# EAGLE design AuxTalon (EAGLE 9.6.2)

## Sheet 1 of 3
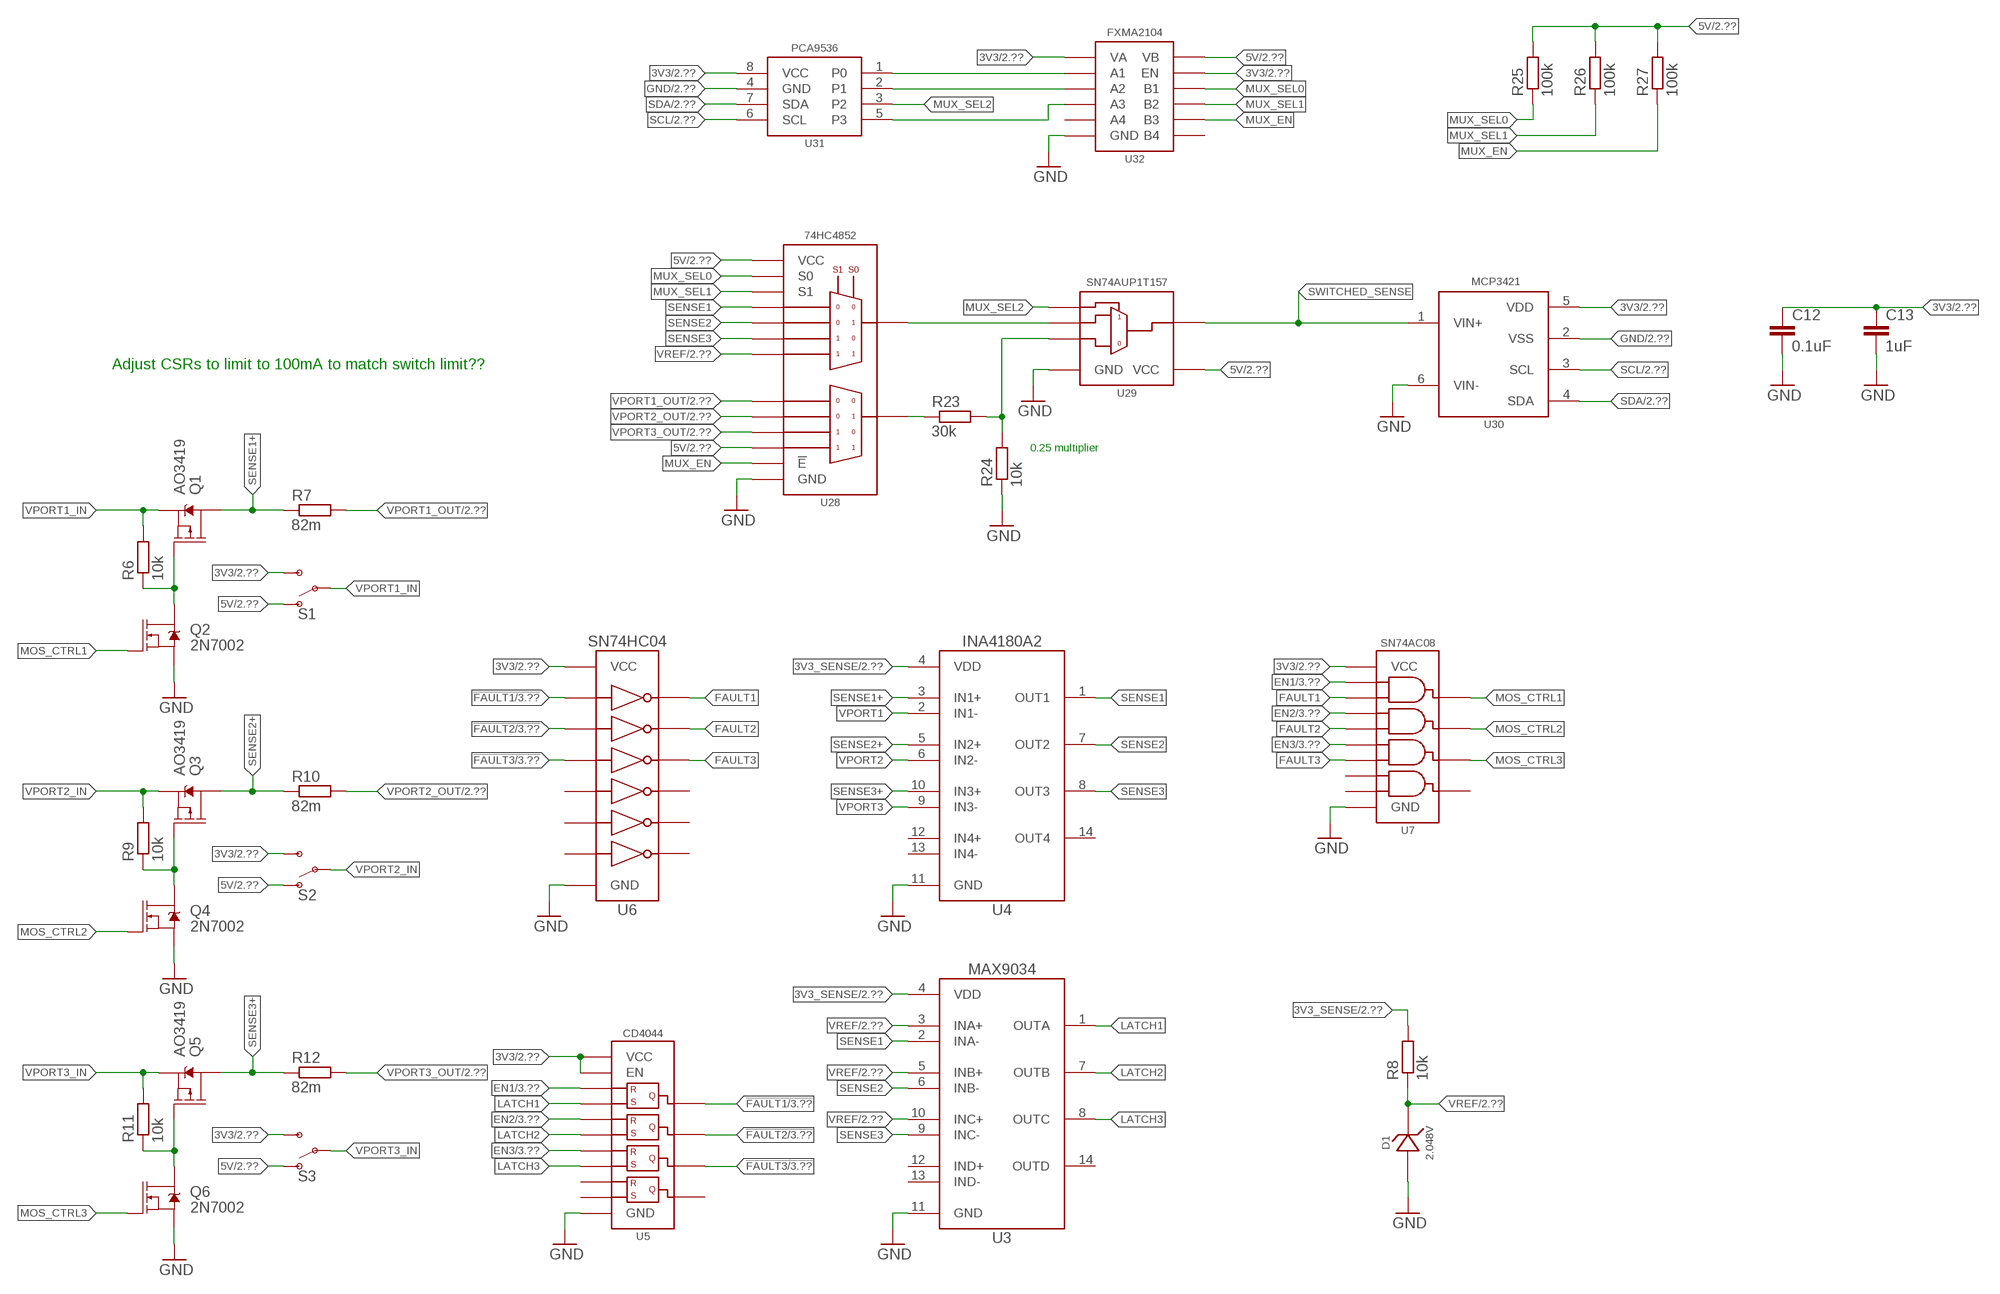
[diagram p0: schematic, sheet 1]

### Parts
C12  0.1uF  C-EU0.1UFC0402  [C0402]
C13  1uF  C-EU10UFC0805  [C0805]
D1  2.048V  LM40402.048  [SOT23-3]
Q1  AO3419  MOSFET-PCH-AO3419  [SOT23-3]
Q2  2N7002  MOSFET-NCH-2N7002P  [SOT23-3]
Q3  AO3419  MOSFET-PCH-AO3419  [SOT23-3]
Q4  2N7002  MOSFET-NCH-2N7002P  [SOT23-3]
Q5  AO3419  MOSFET-PCH-AO3419  [SOT23-3]
Q6  2N7002  MOSFET-NCH-2N7002P  [SOT23-3]
R6  10k  R-EU_10KR0402  [R0402]
R7  82m  R-EU_R0603  [R0603]
R8  10k  R-EU_10KR0402  [R0402]
R9  10k  R-EU_10KR0402  [R0402]
R10  82m  R-EU_R0603  [R0603]
R11  10k  R-EU_10KR0402  [R0402]
R12  82m  R-EU_R0603  [R0603]
R23  30k  R-EU_R0402  [R0402]
R24  10k  R-EU_10KR0402  [R0402]
R25  100k  R-EU_100KR0402  [R0402]
R26  100k  R-EU_100KR0402  [R0402]
R27  100k  R-EU_100KR0402  [R0402]
S1  SPDTCAS-120A1  [CAS-120A1]
S2  SPDTCAS-120A1  [CAS-120A1]
S3  SPDTCAS-120A1  [CAS-120A1]
U3  MAX9034TSSOP  [TSSOP14]
U4  INA4180A2  [TSSOP14]
U5  CD4044  [TSSOP16]
U6  SN74HC04  [TSSOP14]
U7  SN74AC08  [TSSOP14]
U28  74HC4852  [VQFN-16]
U29  SN74AUP1T157DCK  [DCK_R-PDSO-G6]
U30  MCP3421A3  [SOT23-6L]
U31  PCA9536DFN  [DFN_8_3X3]
U32  FXMA2104  [MLP_12]

### Nets
3V3: C12.1 C13.1 S1.3(S) S2.3(S) S3.3(S) U5.5(EN) U5.16(VCC) U6.14(VCC) U7.14(VCC) U30.5(VDD) U31.8(VCC) U32.2(VA) U32.8(EN) ; also sheet 2,3
3V3_SENSE: R8.2 U3.4(VDD) U4.4(VDD) ; also sheet 2
5V: R25.2 R26.2 R27.2 S1.1(O) S2.1(O) S3.1(O) U28.4(2Y3) U28.16(VCC) U29.5(VCC) U32.1(VB) ; also sheet 2
!FAULT1: U5.13(Q1) U6.1(A1) ; also sheet 3
!FAULT2: U5.9(Q2) U6.3(A2) ; also sheet 3
!FAULT3: U5.10(Q3) U6.5(A3) ; also sheet 3
EN1: U5.4(R1) U7.1(A1) ; also sheet 3
EN2: U5.6(R2) U7.4(A2) ; also sheet 3
EN3: U5.12(R3) U7.9(A3) ; also sheet 3
FAULT1: U6.2(Y1) U7.2(B1)
FAULT2: U6.4(Y2) U7.5(B2)
FAULT3: U6.6(Y3) U7.10(B3)
GND: C12.2 C13.2 D1.2(A) Q2.2(S) Q4.2(S) Q6.2(S) R24.1 U3.11(GND) U4.11(GND) U5.8(GND) U6.7(GND) U7.7(GND) U28.8(GND) U28.EP(GND) U29.2(GND) U30.2(VSS) U30.6(VIN-) U31.4(GND) U32.7(GND) ; also sheet 2,3
LATCH1: U3.1(OUTA) U5.3(S1)
LATCH2: U3.7(OUTB) U5.7(S2)
LATCH3: U3.8(OUTC) U5.11(S3)
MOS_CTRL1: Q2.1(G) U7.3(Y1)
MOS_CTRL2: Q4.1(G) U7.6(Y2)
MOS_CTRL3: Q6.1(G) U7.8(Y3)
MUX_EN: R27.1 U28.6(!E) U32.10(B3)
MUX_SEL0: R25.1 U28.10(S0) U32.12(B1)
MUX_SEL1: R26.1 U28.9(S1) U32.11(B2)
MUX_SEL2: U29.4(C) U31.3(P2) ; also sheet 3
N$1: Q3.1(G) Q4.3(D) R9.1
N$2: Q1.1(G) Q2.3(D) R6.1
N$3: Q5.1(G) Q6.3(D) R11.1
N$18: R23.1 U28.3(2Z)
N$19: R23.2 R24.2 U29.3(B)
N$24: U31.1(P0) U32.3(A1)
N$25: U31.2(P1) U32.4(A2)
N$28: U31.5(P3) U32.5(A3)
N$38: U28.13(1Z) U29.1(A)
SCL: U30.3(SCL) U31.6(SCL) ; also sheet 2,3
SDA: U30.4(SDA) U31.7(SDA) ; also sheet 2,3
SENSE1: U3.2(INA-) U4.1(OUT1) U28.12(1Y0)
SENSE1+: Q1.3(D) R7.1 U4.3(IN1+)
SENSE2: U3.6(INB-) U4.7(OUT2) U28.14(1Y1)
SENSE2+: Q3.3(D) R10.1 U4.5(IN2+)
SENSE3: U3.9(INC-) U4.8(OUT3) U28.15(1Y2)
SENSE3+: Q5.3(D) R12.1 U4.10(IN3+)
SWITCHED_SENSE: U29.6(Y) U30.1(VIN+)
VPORT1: U4.2(IN1-)
VPORT1_IN: Q1.2(S) R6.2 S1.2(P)
VPORT1_OUT: R7.2 U28.1(2Y0) ; also sheet 2
VPORT2: U4.6(IN2-)
VPORT2_IN: Q3.2(S) R9.2 S2.2(P)
VPORT2_OUT: R10.2 U28.5(2Y1) ; also sheet 2
VPORT3: U4.9(IN3-)
VPORT3_IN: Q5.2(S) R11.2 S3.2(P)
VPORT3_OUT: R12.2 U28.2(2Y2) ; also sheet 2
VREF: D1.1(C) R8.1 U3.3(INA+) U3.5(INB+) U3.10(INC+) U28.11(1Y3) ; also sheet 2
Unconnected: U3.12(IND+) U3.13(IND-) U3.14(OUTD) U4.12(IN4+) U4.13(IN4-) U4.14(OUT4) U5.1(Q4) U5.14(R4) U5.15(S4) U6.8(Y4) U6.9(A4) U6.10(Y5) U6.11(A5) U6.12(Y6) U6.13(A6) U7.11(Y4) U7.12(A4) U7.13(B4) U32.6(A4) U32.9(B4)

### Notes on the sheet
- Adjust CSRs to limit to 100mA to match switch limit??
- 0.25 multiplier

## Sheet 2 of 3
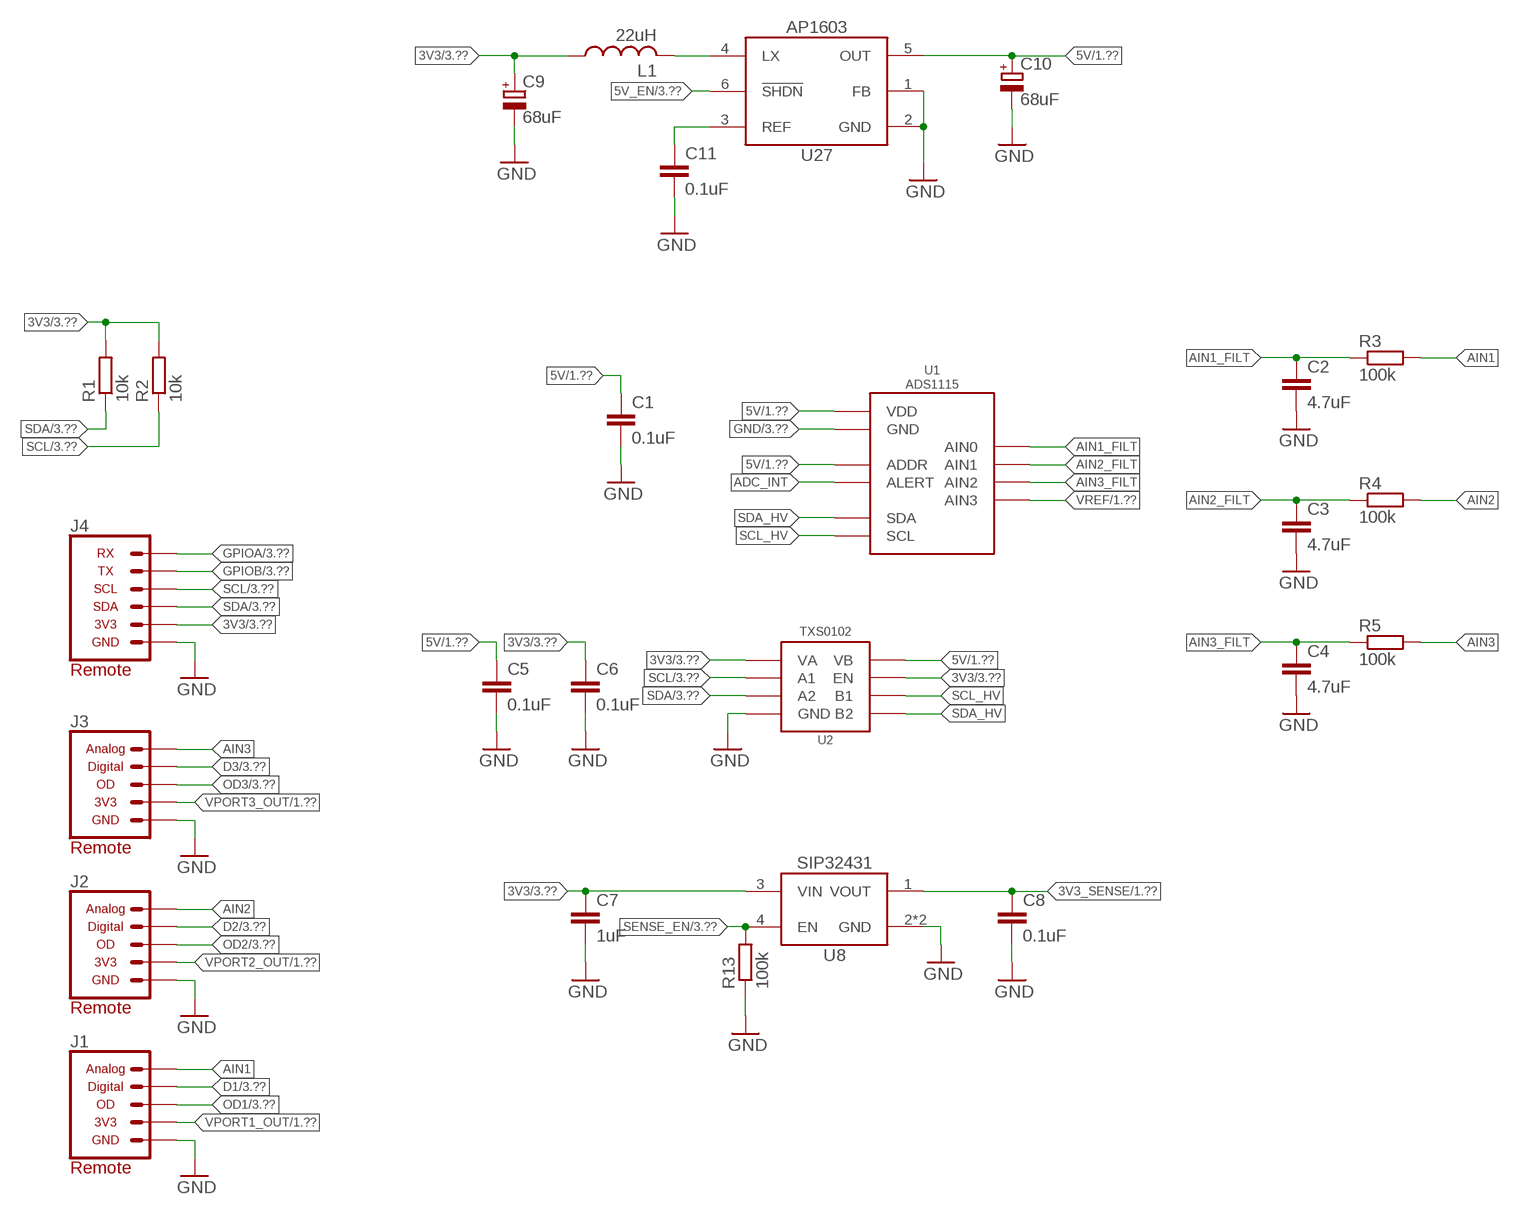
[diagram p1: schematic, sheet 2]

### Parts
C1  0.1uF  C-EU0.1UFC0402  [C0402]
C2  4.7uF  C-EU4.7UFC0805  [C0805]
C3  4.7uF  C-EU4.7UFC0805  [C0805]
C4  4.7uF  C-EU4.7UFC0805  [C0805]
C5  0.1uF  C-EU0.1UFC0402  [C0402]
C6  0.1uF  C-EU0.1UFC0402  [C0402]
C7  1uF  C-EU1UFC0603  [C0603]
C8  0.1uF  C-EU0.1UFC0402  [C0402]
C9  68uF  CPOL-EU153CLV-0605  [153CLV-0605]
C10  68uF  CPOL-EU153CLV-0605  [153CLV-0605]
C11  0.1uF  C-EU0.1UFC0402  [C0402]
J1  CONN_AUX_M12_REMOTE  [1X05_M12_TE_T41410]
J2  CONN_AUX_M12_REMOTE  [1X05_M12_TE_T41410]
J3  CONN_AUX_M12_REMOTE  [1X05_M12_TE_T41410]
J4  CONN_TALON_REMOTE  [1X06_MICROLOCKPLUS]
L1  22uH  INDUCTOR_TPC_3.8X3.8  [WE-TPC(3.8X3.8)]
R1  10k  R-EU_10KR0402  [R0402]
R2  10k  R-EU_10KR0402  [R0402]
R3  100k  R-EU_100KR0402  [R0402]
R4  100k  R-EU_100KR0402  [R0402]
R5  100k  R-EU_100KR0402  [R0402]
R13  100k  R-EU_100KR0402  [R0402]
U1  ADS1115  [VSSOP_10]
U2  TXS0102DCU  [DCU_(R-PDSO-G8)]
U8  SIP32431TDFN  [TDFN_4]
U27  AP1603  [TSOT23-6_DDC]

### Nets
3V3: C6.1 C7.1 C9.+ J4.5(3V3) L1.1 R1.2 R2.2 U2.3(VA) U2.6(EN) U8.3(VIN) ; also sheet 1,3
3V3_SENSE: C8.1 U8.1(VOUT) ; also sheet 1
5V: C1.1 C5.1 C10.+ U1.1(ADDR) U1.8(VDD) U2.7(VB) U27.5(OUT) ; also sheet 1
5V_EN: U27.6(!SHDN) ; also sheet 3
ADC_INT: U1.2(ALERT)
AIN1: J1.4(ANALOG) R3.2
AIN1_FILT: C2.1 R3.1 U1.4(AIN0)
AIN2: J2.4(ANALOG) R4.2
AIN2_FILT: C3.1 R4.1 U1.5(AIN1)
AIN3: J3.4(ANALOG) R5.2
AIN3_FILT: C4.1 R5.1 U1.6(AIN2)
D1: J1.5(DIGITAL) ; also sheet 3
D2: J2.5(DIGITAL) ; also sheet 3
D3: J3.5(DIGITAL) ; also sheet 3
GND: C1.2 C2.2 C3.2 C4.2 C5.2 C6.2 C7.2 C8.2 C9.- C10.- C11.2 J1.3(GND) J2.3(GND) J3.3(GND) J4.6(GND) R13.1 U1.3(GND) U2.2(GND) U8.2(GND) U8.EP(GND) U27.1(FB) U27.2(GND) ; also sheet 1,3
GPIOA: J4.1(RX) ; also sheet 3
GPIOB: J4.2(TX) ; also sheet 3
N$15: C11.1 U27.3(REF)
N$17: L1.2 U27.4(LX)
OD1: J1.2(DIGITAL_OPENDRAIN) ; also sheet 3
OD2: J2.2(DIGITAL_OPENDRAIN) ; also sheet 3
OD3: J3.2(DIGITAL_OPENDRAIN) ; also sheet 3
SCL: J4.3(SCL) R2.1 U2.5(A1) ; also sheet 1,3
SCL_HV: U1.10(SCL) U2.8(B1)
SDA: J4.4(SDA) R1.1 U2.4(A2) ; also sheet 1,3
SDA_HV: U1.9(SDA) U2.1(B2)
SENSE_EN: R13.2 U8.4(EN) ; also sheet 3
VPORT1_OUT: J1.1(3V3) ; also sheet 1
VPORT2_OUT: J2.1(3V3) ; also sheet 1
VPORT3_OUT: J3.1(3V3) ; also sheet 1
VREF: U1.7(AIN3) ; also sheet 1

## Sheet 3 of 3
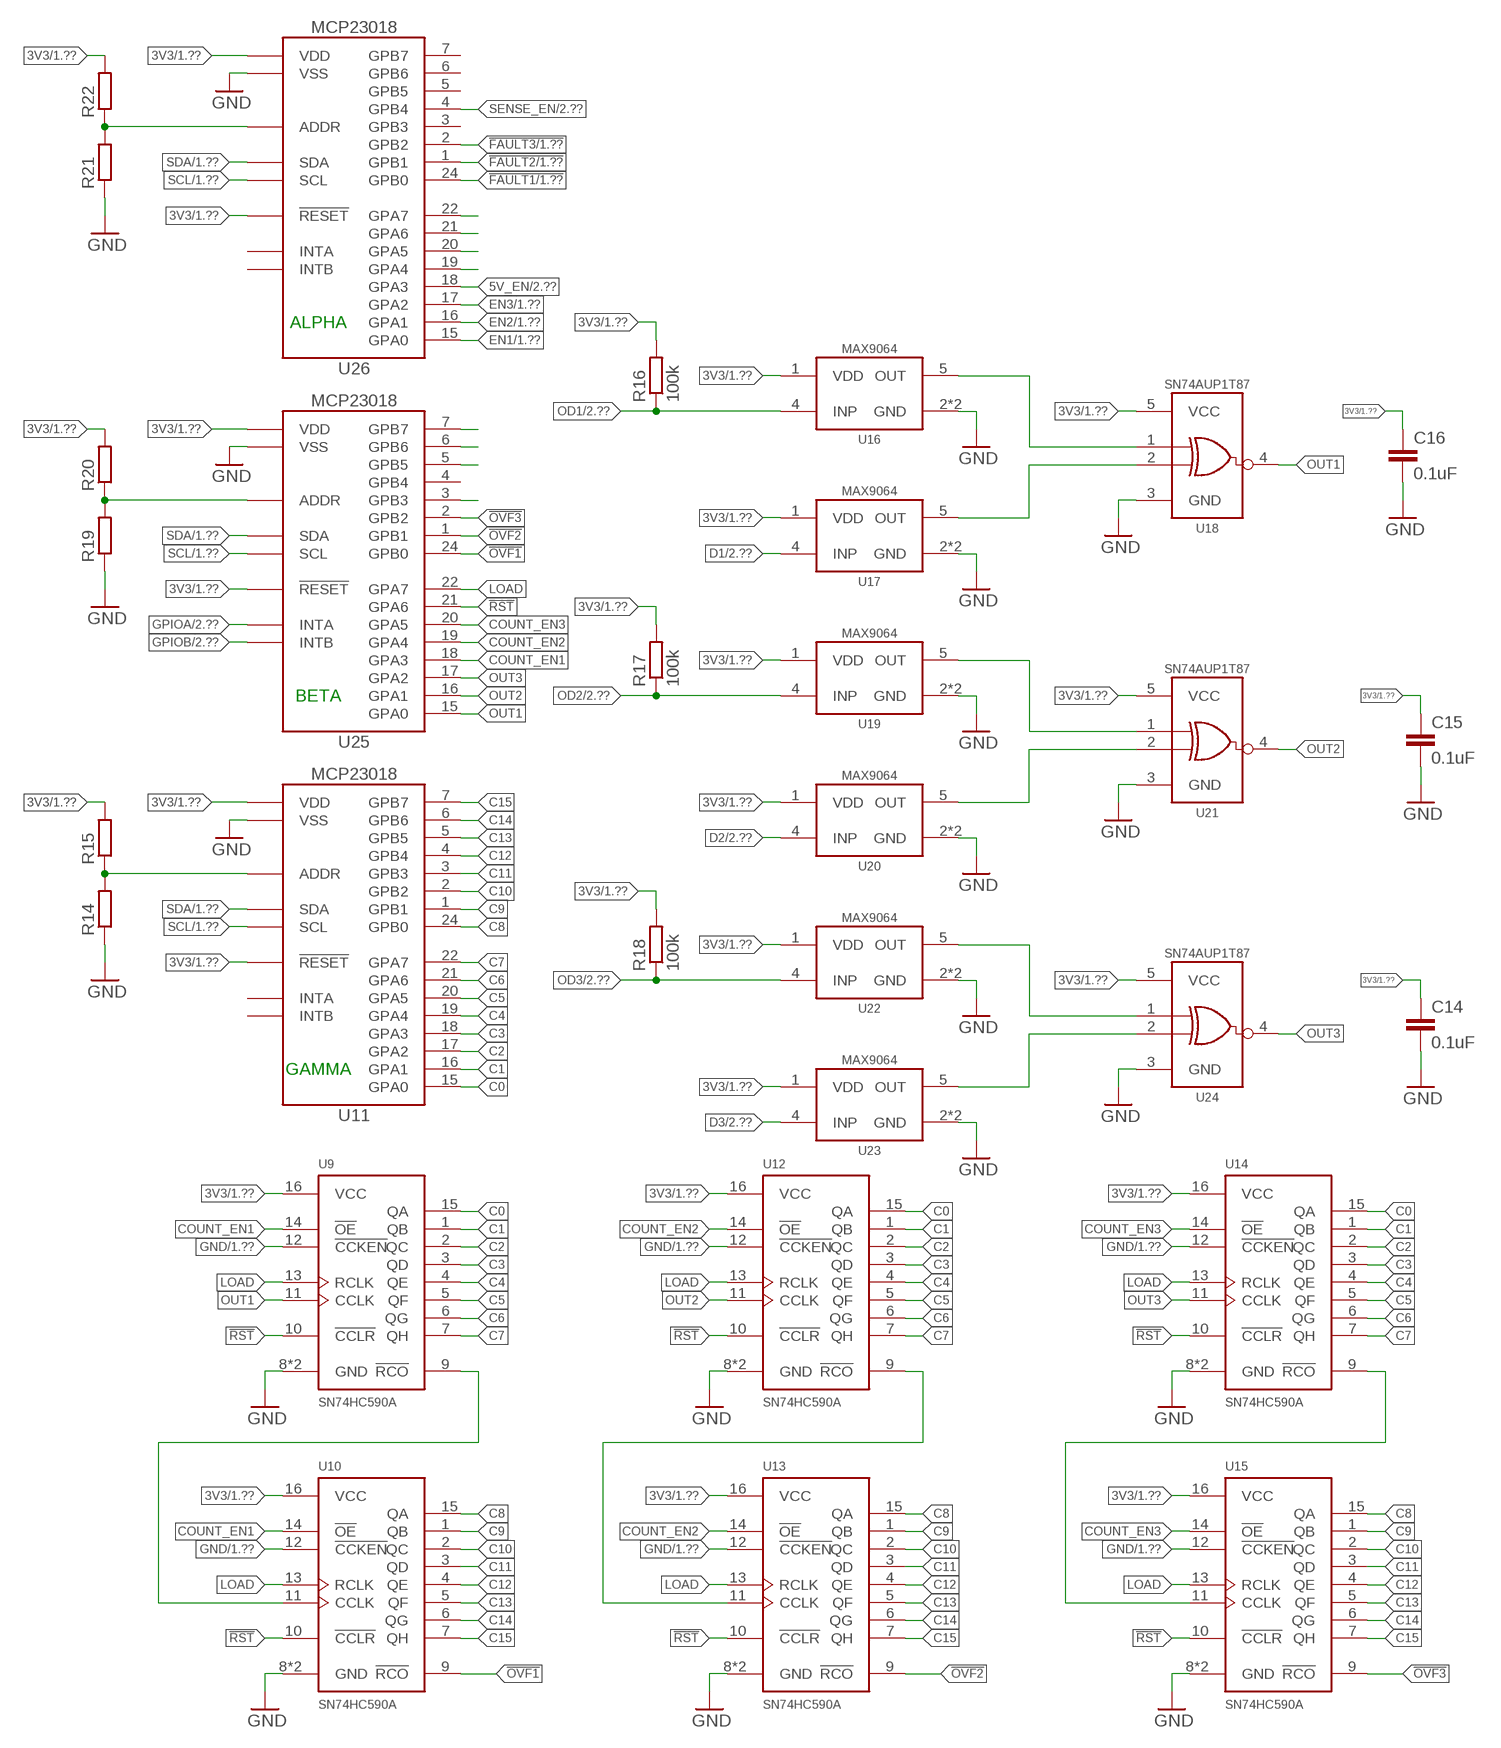
[diagram p2: schematic, sheet 3]

### Parts
C14  0.1uF  C-EU0.1UFC0402  [C0402]
C15  0.1uF  C-EU0.1UFC0402  [C0402]
C16  0.1uF  C-EU0.1UFC0402  [C0402]
R14  R-EU_R0603  [R0603]
R15  R-EU_R0603  [R0603]
R16  100k  R-EU_100KR0402  [R0402]
R17  100k  R-EU_100KR0402  [R0402]
R18  100k  R-EU_100KR0402  [R0402]
R19  R-EU_R0603  [R0603]
R20  R-EU_R0603  [R0603]
R21  R-EU_R0603  [R0603]
R22  R-EU_R0603  [R0603]
U9  SN74HC590AVQFN  [VQFN-16]
U10  SN74HC590AVQFN  [VQFN-16]
U11  MCP23018QFN  [QFN24]
U12  SN74HC590AVQFN  [VQFN-16]
U13  SN74HC590AVQFN  [VQFN-16]
U14  SN74HC590AVQFN  [VQFN-16]
U15  SN74HC590AVQFN  [VQFN-16]
U16  MAX9064  [SOT23-5]
U17  MAX9064  [SOT23-5]
U18  SN74AUP1T87  [DCK_R-PDSO-G5]
U19  MAX9064  [SOT23-5]
U20  MAX9064  [SOT23-5]
U21  SN74AUP1T87  [DCK_R-PDSO-G5]
U22  MAX9064  [SOT23-5]
U23  MAX9064  [SOT23-5]
U24  SN74AUP1T87  [DCK_R-PDSO-G5]
U25  MCP23018QFN  [QFN24]
U26  MCP23018QFN  [QFN24]

### Nets
3V3: C14.1 C15.1 C16.1 R15.2 R16.2 R17.2 R18.2 R20.2 R22.2 U9.16(VCC) U10.16(VCC) U11.8(VDD) U11.12(!RESET) U12.16(VCC) U13.16(VCC) U14.16(VCC) U15.16(VCC) U16.1(VDD) U17.1(VDD) U18.5(VCC) U19.1(VDD) U20.1(VDD) U21.5(VCC) U22.1(VDD) U23.1(VDD) U24.5(VCC) U25.8(VDD) U25.12(!RESET) U26.8(VDD) U26.12(!RESET) ; also sheet 1,2
5V_EN: U26.18(GPA3) ; also sheet 2
!FAULT1: U26.24(GPB0) ; also sheet 1
!FAULT2: U26.1(GPB1) ; also sheet 1
!FAULT3: U26.2(GPB2) ; also sheet 1
!OVF1: U10.9(!RCO) U25.24(GPB0)
!OVF2: U13.9(!RCO) U25.1(GPB1)
!OVF3: U15.9(!RCO) U25.2(GPB2)
!RST: U9.10(!CCLR) U10.10(!CCLR) U12.10(!CCLR) U13.10(!CCLR) U14.10(!CCLR) U15.10(!CCLR) U25.21(GPA6)
C0: U9.15(QA) U11.15(GPA0) U12.15(QA) U14.15(QA)
C1: U9.1(QB) U11.16(GPA1) U12.1(QB) U14.1(QB)
C2: U9.2(QC) U11.17(GPA2) U12.2(QC) U14.2(QC)
C3: U9.3(QD) U11.18(GPA3) U12.3(QD) U14.3(QD)
C4: U9.4(QE) U11.19(GPA4) U12.4(QE) U14.4(QE)
C5: U9.5(QF) U11.20(GPA5) U12.5(QF) U14.5(QF)
C6: U9.6(QG) U11.21(GPA6) U12.6(QG) U14.6(QG)
C7: U9.7(QH) U11.22(GPA7) U12.7(QH) U14.7(QH)
C8: U10.15(QA) U11.24(GPB0) U13.15(QA) U15.15(QA)
C9: U10.1(QB) U11.1(GPB1) U13.1(QB) U15.1(QB)
C10: U10.2(QC) U11.2(GPB2) U13.2(QC) U15.2(QC)
C11: U10.3(QD) U11.3(GPB3) U13.3(QD) U15.3(QD)
C12: U10.4(QE) U11.4(GPB4) U13.4(QE) U15.4(QE)
C13: U10.5(QF) U11.5(GPB5) U13.5(QF) U15.5(QF)
C14: U10.6(QG) U11.6(GPB6) U13.6(QG) U15.6(QG)
C15: U10.7(QH) U11.7(GPB7) U13.7(QH) U15.7(QH)
COUNT_EN1: U9.14(!OE) U10.14(!OE) U25.18(GPA3)
COUNT_EN2: U12.14(!OE) U13.14(!OE) U25.19(GPA4)
COUNT_EN3: U14.14(!OE) U15.14(!OE) U25.20(GPA5)
D1: U17.4(INP) ; also sheet 2
D2: U20.4(INP) ; also sheet 2
D3: U23.4(INP) ; also sheet 2
EN1: U26.15(GPA0) ; also sheet 1
EN2: U26.16(GPA1) ; also sheet 1
EN3: U26.17(GPA2) ; also sheet 1
GND: C14.2 C15.2 C16.2 R14.1 R19.1 R21.1 U9.8(GND) U9.12(!CCKEN) U9.EP(GND) U10.8(GND) U10.12(!CCKEN) U10.EP(GND) U11.23(VSS) U11.EP(VSS) U12.8(GND) U12.12(!CCKEN) U12.EP(GND) U13.8(GND) U13.12(!CCKEN) U13.EP(GND) U14.8(GND) U14.12(!CCKEN) U14.EP(GND) U15.8(GND) U15.12(!CCKEN) U15.EP(GND) U16.2(GND) U16.3(GND) U17.2(GND) U17.3(GND) U18.3(GND) U19.2(GND) U19.3(GND) U20.2(GND) U20.3(GND) U21.3(GND) U22.2(GND) U22.3(GND) U23.2(GND) U23.3(GND) U24.3(GND) U25.23(VSS) U25.EP(VSS) U26.23(VSS) U26.EP(VSS) ; also sheet 1,2
GPIOA: U25.14(INTA) ; also sheet 2
GPIOB: U25.13(INTB) ; also sheet 2
LOAD: U9.13(RCLK) U10.13(RCLK) U12.13(RCLK) U13.13(RCLK) U14.13(RCLK) U15.13(RCLK) U25.22(GPA7)
MUX_SEL2: U25.5(GPB5) ; also sheet 1
N$4: U9.9(!RCO) U10.11(CCLK)
N$5: U12.9(!RCO) U13.11(CCLK)
N$6: U14.9(!RCO) U15.11(CCLK)
N$7: R14.2 R15.1 U11.11(ADDR)
N$8: U20.5(OUT) U21.2(B)
N$9: U19.5(OUT) U21.1(A)
N$10: U16.5(OUT) U18.1(A)
N$11: U17.5(OUT) U18.2(B)
N$12: U23.5(OUT) U24.2(B)
N$13: U22.5(OUT) U24.1(A)
N$14: R21.2 R22.1 U26.11(ADDR)
N$16: R19.2 R20.1 U25.11(ADDR)
N$20: U26.19(GPA4)
N$21: U26.20(GPA5)
N$22: U26.21(GPA6)
N$23: U26.22(GPA7)
N$26: U25.3(GPB3)
N$29: U25.6(GPB6)
N$30: U25.7(GPB7)
OD1: R16.1 U16.4(INP) ; also sheet 2
OD2: R17.1 U19.4(INP) ; also sheet 2
OD3: R18.1 U22.4(INP) ; also sheet 2
OUT1: U9.11(CCLK) U18.4(Y) U25.15(GPA0)
OUT2: U12.11(CCLK) U21.4(Y) U25.16(GPA1)
OUT3: U14.11(CCLK) U24.4(Y) U25.17(GPA2)
SCL: U11.9(SCL) U25.9(SCL) U26.9(SCL) ; also sheet 1,2
SDA: U11.10(SDA) U25.10(SDA) U26.10(SDA) ; also sheet 1,2
SENSE_EN: U26.4(GPB4) ; also sheet 2
Unconnected: U11.13(INTB) U11.14(INTA) U25.4(GPB4) U26.3(GPB3) U26.5(GPB5) U26.6(GPB6) U26.7(GPB7) U26.13(INTB) U26.14(INTA)

### Notes on the sheet
- ALPHA
- BETA
- GAMMA

## Library data of the parts
C1 C5 C6 C8 C11 C12 C14-C16 = bschulz_passives:C-EU: CAPACITOR, European symbol; DIGIKEY: 490-4759-1-ND; MF: Murata; MPN: GCM155R71C104KA55D
C2-C4 = bschulz_passives:C-EU: CAPACITOR, European symbol; DIGIKEY: 399-7415-1-ND; MF: Kemet; MPN: C0805C475K4RACTU
C7 = bschulz_passives:C-EU: CAPACITOR, European symbol; DIGIKEY: 587-1251-1-ND; MF: Yaiyo Yuden; MPN: EMK107BJ105KA-T
C9 C10 = bschulz_passives:CPOL-EU: POLARIZED CAPACITOR, European symbol; SPICEPREFIX: C
C13 = bschulz_passives:C-EU: CAPACITOR, European symbol; DIGIKEY: 490-6473-1-ND; MF: Murata; MPN: GRM21BR61C106KE15K
D1 = bschulz:LM4040: LM4040 - Precision Micropower Shunt Voltage Referance Characteristics: VReverseBreakdown: 1.225V, 2.5V, 4.096V, 5.0V Output Current: 15 mA Tolerance: 1% Temp Coeficient: ±15ppm/C° Operating Temperature: -40°C to 85°C Digikey: 576-1047-1-ND (Microchip, 2.5V) <https://www.digikey.com/product-detail/en/microchip-technology/LM4040DYM3-2.5-TR/576-1047-1-ND/771818> 576-1048-1-ND (Microchip, 4.096V) <https://www.digikey.com/product-detail/en/microchip-technology/LM4040DYM3-4.1-TR/576-1048-1-ND/771819> 5LM4040CIM3-2.0/NOPBCT-ND (TI, 2.048V) <https://www.digikey.com/product-detail/en/texas-instruments/LM4040CIM3-2.0-NOPB/LM4040CIM3-2.0-NOPBCT-ND/2350623>; DIGIKEY: LM4040CIM3-2.0/NOPBCT-ND; MF: TI; MPN: LM4040CIM3-2.0/NOPB
J1-J3 = GEMS_Plugs:CONN_AUX: GEMS Connector for Auiliary Port Devices; DIGIKEY: A126851-ND; DISP: Remote; MF: TE; MPN: T4141012051-000
J4 = GEMS_Plugs:CONN_TALON: GEMS Connector for Talon Interface; DISP: Remote
L1 = bschulz:INDUCTOR: Genaric Inductor
Q1 Q3 Q5 = bschulz:MOSFET-PCH: P-channel MOSFET Small Signal/Low Power:; DIGIKEY: 785-1013-1-ND; MF: Alpha and Omega; MPN: AO3419
Q2 Q4 Q6 = bschulz:MOSFET-NCH: N-channel MOSFET Small Signal/Low Power: BSS138 2N7002P 2N7002PW RE1C002UN; DIGIKEY: 1727-4692-1-ND; MF: Nexperia; MPN: 2N7002P,215
R1 R2 R6 R8 R9 R11 R24 = bschulz_passives:R-EU_: RESISTOR, European symbol Digikey Parts: Yageo, 0402 <https://www.digikey.com/products/en/resistors/chip-resistor-surface-mount/52?k=&pkeyword=&sv=0&s=4356&sf=1&FV=-1%7C13%2C7%7C2%2C1291%7C39157%2C1989%7C0%2C-8%7C52%2C3%7C1131%2C3%7C2503&quantity=&ColumnSort=0&page=1&stock=1&pageSize=25> Yageo, 0603 <https://www.digikey.com/products/en/resistors/chip-resistor-surface-mount/52?k=&pkeyword=&sv=0&pv1291=39245&sf=1&FV=-5%7C4356%2C-5%7C47360%2C-8%7C52%2C-1%7C13%2C7%7C2%2C1989%7C0&quantity=10&ColumnSort=1000011&page=1&stock=1&pageSize=25> Panasonic, 0603 <https://www.digikey.com/products/en/resistors/chip-resistor-surface-mount/52?k=&pkeyword=&pv252=68&sf=0&FV=ffec373d%2C1c0002%2C142c040c%2C1f140000%2Cffe00034%2C80002%2Cc0001&quantity=&ColumnSort=0&page=1&stock=1&pageSize=25> Panasonic, precision, 0603 <https://www.digikey.com/products/en/resistors/chip-resistor-surface-mount/52?FV=ffec4907%2Cfffc000a%2Cc0172%2C142c040c%2C1f140000%2Cffe00034%2C1c0002&quantity=100&ColumnSort=2085&page=1&stock=1&pageSize=25> Panasonic, 0805 <https://www.digikey.com/products/en/resistors/chip-resistor-surface-mount/52?k=&pkeyword=&pv3=1&sf=0&FV=ffec373d%2C1c0002%2C1f140000%2Cffe00034%2C142c040d&quantity=&ColumnSort=0&page=1&stock=1&pageSize=25> Rohm, current sense <https://www.digikey.com/products/en/resistors/chip-resistor-surface-mount/52?k=&pkeyword=&pv3=1&sf=0&FV=ffecb688%2C1f140000%2Cffe00034%2C1c0002&quantity=&ColumnSort=0&page=1&stock=1&pageSize=25> Vishay, pulse proof automotive <https://www.digikey.com/products/en/resistors/chip-resistor-surface-mount/52?k=&pkeyword=&pv7=2&sf=0&FV=ffec5d6b%2Cffe00034%2C1f140000&quantity=&ColumnSort=0&page=1&stock=1&pageSize=25>; DIGIKEY: 311-10.0KLRCT-ND; MF: Yageo; MPN: RC0402FR-0710KL; VALUE_PART: 10k
R3-R5 R13 R16-R18 R25-R27 = bschulz_passives:R-EU_: RESISTOR, European symbol Digikey Parts: Yageo, 0402 <https://www.digikey.com/products/en/resistors/chip-resistor-surface-mount/52?k=&pkeyword=&sv=0&s=4356&sf=1&FV=-1%7C13%2C7%7C2%2C1291%7C39157%2C1989%7C0%2C-8%7C52%2C3%7C1131%2C3%7C2503&quantity=&ColumnSort=0&page=1&stock=1&pageSize=25> Yageo, 0603 <https://www.digikey.com/products/en/resistors/chip-resistor-surface-mount/52?k=&pkeyword=&sv=0&pv1291=39245&sf=1&FV=-5%7C4356%2C-5%7C47360%2C-8%7C52%2C-1%7C13%2C7%7C2%2C1989%7C0&quantity=10&ColumnSort=1000011&page=1&stock=1&pageSize=25> Panasonic, 0603 <https://www.digikey.com/products/en/resistors/chip-resistor-surface-mount/52?k=&pkeyword=&pv252=68&sf=0&FV=ffec373d%2C1c0002%2C142c040c%2C1f140000%2Cffe00034%2C80002%2Cc0001&quantity=&ColumnSort=0&page=1&stock=1&pageSize=25> Panasonic, precision, 0603 <https://www.digikey.com/products/en/resistors/chip-resistor-surface-mount/52?FV=ffec4907%2Cfffc000a%2Cc0172%2C142c040c%2C1f140000%2Cffe00034%2C1c0002&quantity=100&ColumnSort=2085&page=1&stock=1&pageSize=25> Panasonic, 0805 <https://www.digikey.com/products/en/resistors/chip-resistor-surface-mount/52?k=&pkeyword=&pv3=1&sf=0&FV=ffec373d%2C1c0002%2C1f140000%2Cffe00034%2C142c040d&quantity=&ColumnSort=0&page=1&stock=1&pageSize=25> Rohm, current sense <https://www.digikey.com/products/en/resistors/chip-resistor-surface-mount/52?k=&pkeyword=&pv3=1&sf=0&FV=ffecb688%2C1f140000%2Cffe00034%2C1c0002&quantity=&ColumnSort=0&page=1&stock=1&pageSize=25> Vishay, pulse proof automotive <https://www.digikey.com/products/en/resistors/chip-resistor-surface-mount/52?k=&pkeyword=&pv7=2&sf=0&FV=ffec5d6b%2Cffe00034%2C1f140000&quantity=&ColumnSort=0&page=1&stock=1&pageSize=25>; DIGIKEY: 311-100KLRCT-ND; MF: Yageo; MPN: RC0402FR-07100KL; VALUE_PART: 100k
R7 R10 R12 R14 R15 R19-R23 = bschulz_passives:R-EU_: RESISTOR, European symbol Digikey Parts: Yageo, 0402 <https://www.digikey.com/products/en/resistors/chip-resistor-surface-mount/52?k=&pkeyword=&sv=0&s=4356&sf=1&FV=-1%7C13%2C7%7C2%2C1291%7C39157%2C1989%7C0%2C-8%7C52%2C3%7C1131%2C3%7C2503&quantity=&ColumnSort=0&page=1&stock=1&pageSize=25> Yageo, 0603 <https://www.digikey.com/products/en/resistors/chip-resistor-surface-mount/52?k=&pkeyword=&sv=0&pv1291=39245&sf=1&FV=-5%7C4356%2C-5%7C47360%2C-8%7C52%2C-1%7C13%2C7%7C2%2C1989%7C0&quantity=10&ColumnSort=1000011&page=1&stock=1&pageSize=25> Panasonic, 0603 <https://www.digikey.com/products/en/resistors/chip-resistor-surface-mount/52?k=&pkeyword=&pv252=68&sf=0&FV=ffec373d%2C1c0002%2C142c040c%2C1f140000%2Cffe00034%2C80002%2Cc0001&quantity=&ColumnSort=0&page=1&stock=1&pageSize=25> Panasonic, precision, 0603 <https://www.digikey.com/products/en/resistors/chip-resistor-surface-mount/52?FV=ffec4907%2Cfffc000a%2Cc0172%2C142c040c%2C1f140000%2Cffe00034%2C1c0002&quantity=100&ColumnSort=2085&page=1&stock=1&pageSize=25> Panasonic, 0805 <https://www.digikey.com/products/en/resistors/chip-resistor-surface-mount/52?k=&pkeyword=&pv3=1&sf=0&FV=ffec373d%2C1c0002%2C1f140000%2Cffe00034%2C142c040d&quantity=&ColumnSort=0&page=1&stock=1&pageSize=25> Rohm, current sense <https://www.digikey.com/products/en/resistors/chip-resistor-surface-mount/52?k=&pkeyword=&pv3=1&sf=0&FV=ffecb688%2C1f140000%2Cffe00034%2C1c0002&quantity=&ColumnSort=0&page=1&stock=1&pageSize=25> Vishay, pulse proof automotive <https://www.digikey.com/products/en/resistors/chip-resistor-surface-mount/52?k=&pkeyword=&pv7=2&sf=0&FV=ffec5d6b%2Cffe00034%2C1f140000&quantity=&ColumnSort=0&page=1&stock=1&pageSize=25>; MF: Yageo
S1-S3 = bschulz:SPDT: Genaric SPDT switch; DIGIKEY: CAS120JCT-ND; MF: Nidec Copal; MPN: CAS-120TA
U1 = bschulz:ADS111*: ADS1115 - Sigma Delta ADC Characteristics: VCC: 2~5.5V Resolution: 16 bits (12 bits for ADS1015) Number of Inputs: 4 (2 Differenital) Sample Rate: 860 Samples Per Second (3300 for ADS1015) Operating Temperature: -40°C to 125°C Digikey: 296-38849-1-ND (ADS1115) <https://www.digikey.com/scripts/DkSearch/dksus.dll?Detail&itemSeq=258904888&uq=636603311183646020> 296-41185-1-ND (ADS1015) <https://www.digikey.com/product-detail/en/texas-instruments/ADS1015IDGSR/296-41185-1-ND/5222640>; DIGIKEY: 296-38849-1-ND; MF: TI; MPN: ADS1115IDGSR
U2 = bschulz:TXS0102: TXS0102 - 2 Channel Bidirectional Voltage Level Translator Characteristics: Vcc: 1.65 ~ 3.6V (Port A), 2.3 ~ 5.5V (Port B) IQ: 14.4μA Output Current: 50mA Output Type: Open Drain/Push-Pull Operating Temperature: -40°C to 85°C Digikey: 296-28368-1-ND (DQE) <https://www.digikey.com/product-detail/en/texas-instruments/TXS0102DQER/296-28368-1-ND/2625893> 296-28435-1-ND (DQM) <https://www.digikey.com/product-detail/en/texas-instruments/TXS0102DQMR/296-28435-1-ND/2638910> 296-21931-1-ND (DCU) <https://www.digikey.com/product-detail/en/texas-instruments/TXS0102DCUR/296-21931-1-ND/1629284> 296-TXS0102YZCT-ND (YZP) <https://www.digikey.com/en/products/detail/texas-instruments/TXS0102YZTR/1910174>; DIGIKEY: 296-21931-1-ND; MF: TI; MPN: TXS0102DCUR
U3 = bschulz:MAX9034: MAX9034 - Ultra-Small nanoPower Single Comparator , Quad Characteristics: Vin: 2.5V ~ 5.5V Response Time: 188ns IQ: 35μA Internal Ref Operating Temperature: -40°C to 85°C Digikey: MAX9034AUD+CT-ND (TSSOP) <https://www.digikey.com/en/products/detail/maxim-integrated/MAX9034AUD-T/1498905>; DIGIKEY: MAX9034AUD+CT-ND; DISP: MAX9034; MF: Maxim; MPN: MAX9034AUD+T
U4 = bschulz:INA4180: INA4180 - Analog Output Current Sense Amplifier Characteristics: Vs: 2.7V ~ 5V Iq: 690μA Common Mode Range: 0V ~ 26V Gain: 20, 50, 100, 200 V/V (A1, A2, A3, A4) Operating Temperature: -40°C to 125°C Digikey: INA4180A2 <https://www.digikey.com/en/products/detail/texas-instruments/INA4180A2IPWR/8676289>; DIGIKEY: 296-49095-1-ND; DISP: INA4180A2; MF: TI; MPN: INA4180A2IPWR
U5 = bschulz:CD404*: CD404x - S-R Latch, Quad Characteristics: VCC: 3 ~ 18V Operating Temperature: -40°C to 85°C Digikey: CD4044 <https://www.digikey.com/en/products/detail/texas-instruments/CD4044BPWR/1691075>; DIGIKEY: 296-31499-1-ND; DISP: CD4044; MF: TI; MPN: CD4044BPWR
U6 = bschulz:SN74HC04: SN74HC04 - NOT, 4 Element, 1 Input - Hex Inverter Characteristics: VCC: 2 ~ 6Vv IQ = <2μA Operating Temperature: -40°C to 85°C Digikey: 296-8208-1-ND <https://www.digikey.com/en/products/detail/texas-instruments/SN74HC04PWR/377033>; DIGIKEY: 296-8208-1-ND; MF: TI; MPN: SN74HC04PWR
U7 = bschulz:SN74AC08: SN74AC08 - AND, 4 Element, 2 Input Characteristics: VCC: 2 ~ 6V IQ = <2μA Operating Temperature: -40°C to 85°C Digikey: 296-4292-1-ND <https://www.digikey.com/en/products/detail/texas-instruments/SN74AC08PWR/376110>; DIGIKEY: 296-4292-1-ND; MF: TI; MPN: SN74AC08PWR
U8 = bschulz:SIP3243*: SiP3243x - Ultra Low Leakage Load Switch with Reverse Blocking Characteristics: Vin: 1.5 ~ 5.5V IQ: 0.01 nA RDS(ON): 105mΩ (Vin = 5v), 135mΩ (Vin = 3v) Output Current: 1.4A Operating Temperature: -40°C to 125°C Digikey: SIP32431DNP3-T1GE4CT-ND <https://www.digikey.com/en/products/detail/SIP32431DNP3-T1GE4/SIP32431DNP3-T1GE4CT-ND/2673920?itemSeq=377306935>; DIGIKEY: SIP32431DNP3-T1GE4CT-ND; DISP: SIP32431; MF: Vishay; MPN: SIP32431DNP3-T1GE4
U9 U10 U12-U15 = bschulz:SN74HC590A: SN74HC590A - 8 bit binary counter with direct clear Characteristics: VCC: 2~6V Operating Temperature: -40°C to 85°C fmax = 2.5 MHz (for Vcc = 2v, high for higher Vcc) Digikey: 296-8340-5-ND (SOIC) <https://www.digikey.com/product-detail/en/texas-instruments/SN74HC590AD/296-8340-5-ND/376756> 296-1599-5-ND (DIP) <https://www.digikey.com/product-detail/en/texas-instruments/SN74HC590AN/296-1599-5-ND/277245> 1727-6923-1-ND (VQFN) <https://www.digikey.com/en/products/detail/74HC590BQ%2c115/1727-6923-1-ND/2814162?itemSeq=377216928>; DIGIKEY: 1727-6923-1-ND; MF: Nexperia; MPN: 74HC590BQ,115
U11 U25 U26 = bschulz:MCP23018: MCP23018 - I2C I/O Expander, 16 bit wtih interrupt and reset Characteristics: Vcc: 1.8V ~ 5.5V IOut: 25 mA IQ: 1μA Operating Temperature: -40°C to 85°C Internal Configurable Pullups Digikey: MCP23018T-E/MJCT-ND (QFN) <https://www.digikey.com/products/en/integrated-circuits-ics/interface-i-o-expanders/749?k=mcp23018&k=&pkeyword=mcp23018&sv=0&pv1291=4438&sf=0&FV=ffe002ed%2C1c0002%2C1140003&quantity=&ColumnSort=0&page=1&stock=1&pageSize=25>; DIGIKEY: MCP23018T-E/MJCT-ND; MF: TI; MPN: MCP23018T-E/MJ
U16 U17 U19 U20 U22 U23 = bschulz:MAX906*: MAX906x - Ultra-Small nanoPower Single Comparator Characteristics: Vin: 1V ~ 5.5V Response Time: 15us IQ: 100nA Internal Ref Option Open Drain Output Option Inverting Option Operating Temperature: -40°C to 85°C Digikey: MAX9064EUK+TCT-ND (SOT-23-5) <https://www.digikey.com/en/products/detail/maxim-integrated/MAX9064EUK-T/1937852>; DIGIKEY: MAX9064EUK+TCT-ND; DISP: MAX9064; MF: Maxim; MPN: MAX9064EUK+T
U18 U21 U24 = bschulz:SN74AUP1T87: SN74AUP1T87 - XNOR, 1 Element, 2 Input Characteristics: VCC: 2.3 ~ 3.6v IQ = 0.1μA Operating Temperature: -40°C to 85°C Digikey: 296-27398-1-ND (SC-70) <https://www.digikey.com/en/products/detail/texas-instruments/SN74AUP1T87DCKR/2280359?s=N4IgTCBcDaIMoDkDsAWAggVQAoEYAqAHEiALoC%2BQA>; DIGIKEY: 296-27398-1-ND; DISP: SN74AUP1T87; MF: TI; MPN: SN74AUP1T87DCKR
U27 = bschulz:AP1603: AP1603 - Low-Input Voltage Step-Up Converter (Boost) Characteristics: Vin: 0.9V ~ 5.5V Vout: 2V ~ 5.5V Output Current (Max): 150 mA IQ: 16μA Operating Temperature: -40°C to 85°C Digikey: AP1603WG-7DICT-ND <https://www.digikey.com/en/products/detail/diodes-incorporated/AP1603WG-7/4570635>; DIGIKEY: AP1603WG-7DICT-ND; MF: Diodes; MPN: AP1603WG-7
U28 = bschulz:74HC4852: 74HC4852 - Analog Multiplexer, Dual 4-Channel (1:4 x 2) Characteristics: VCC: 2 ~ 6V RON: 195Ω RCh-Ch: 3Ω, max Operating Temperature: -40°C to 85°C Digikey: 1727-7953-1-ND <https://www.digikey.com/en/products/detail/nexperia-usa-inc/74HC4852BQ-Q100-11/3678903>; DIGIKEY: 1727-7953-1-ND; DISP: 74HC4852; MF: Nexperia; MPN: 74HC4852BQ-Q100,11
U29 = bschulz:SN74AUP1T157: SN74AUP1T157 - Non-Inverting Digital Multiplexer, Schmitt Trigger (1:2) Characteristics: VCC: 2.3~3.3V Operating Temperature: -40°C to 85°C Digikey: 296-27393-1-ND <https://www.digikey.com/product-detail/en/texas-instruments/SN74AUP1T157DCKR/296-27393-1-ND/2280367>; DIGIKEY: 296-27393-1-ND; DISP: SN74AUP1T157; MF: TI; MPN: SN74AUP1T157DCKR
U30 = bschulz:MCP342*: MCP342* - Sigma Delta ADC Characteristics: VCC: 2.7~5.5V Operating Temperature: -40°C to 125°C Number of Inputs: 1 (Differenital) Sample Rate: 15 Samples Per Second Number of Bits: 16 (MCP3425), 18 (MCP3421) Digikey: MCP3421 MCP3425A0T-E/CHCT-ND <https://www.digikey.com/product-detail/en/microchip-technology/MCP3425A0T-E-CH/MCP3425A0T-E-CHCT-ND/1979810> MCP3425 MCP3421A0T-E/CHCT-ND <https://www.digikey.com/product-detail/en/microchip-technology/MCP3421A0T-E-CH/MCP3421A0T-E-CHCT-ND/2183406> MCP3421A1T-E/CHCT-ND <https://www.digikey.com/product-detail/en/microchip-technology/MCP3421A1T-E-CH/MCP3421A1T-E-CHCT-ND/2183407> MCP3421A3T-E/CHCT-ND <https://www.digikey.com/product-detail/en/microchip-technology/MCP3421A3T-E-CH/MCP3421A3T-E-CHCT-ND/2183409>; DIGIKEY: MCP3421A3T-E/CHCT-ND; DISP: MCP3421; MF: Microchip; MPN: MCP3421A3T-E/CH
U31 = bschulz:PCA9536: PCA9536 - I2C I/O Expander, 4 bit, 5V tollerant Characteristics: Vcc: 2.3V ~ 5.5V IOut: >10mA IQ: 1μA Operating Temperature: -40°C to 85°C Internal Pullups Digikey: 296-20952-1-ND (DGK) <https://www.digikey.com/product-detail/en/texas-instruments/PCA9536DGKR/296-20952-1-ND/1216922> 568-4079-1-ND (SON) <https://www.digikey.com/en/products/detail/nxp-usa-inc/PCA9536TK-118/1300978>; DIGIKEY: 568-4079-1-ND; MF: NXP; MPN: PCA9536TK,118
U32 = bschulz:FXMA2104: FXMA2104 - 4 Channel Bidirectional Open Drain Voltage Level Translator Characteristics: Vcc: 1.65 ~ 5.5V (Port A), 1.65 ~ 5.5V (Port B) IQ: 5μA Output Current: 50mA Output Type: Open Drain Operating Temperature: -40°C to 85°C Digikey: FXMA2104UMXCT-ND <https://www.digikey.com/en/products/detail/onsemi/FXMA2104UMX/3163299>; DIGIKEY: FXMA2104UMXCT-ND; DISP: FXMA2104; MF: OnSemi; MPN: FXMA2104UMX

## Board
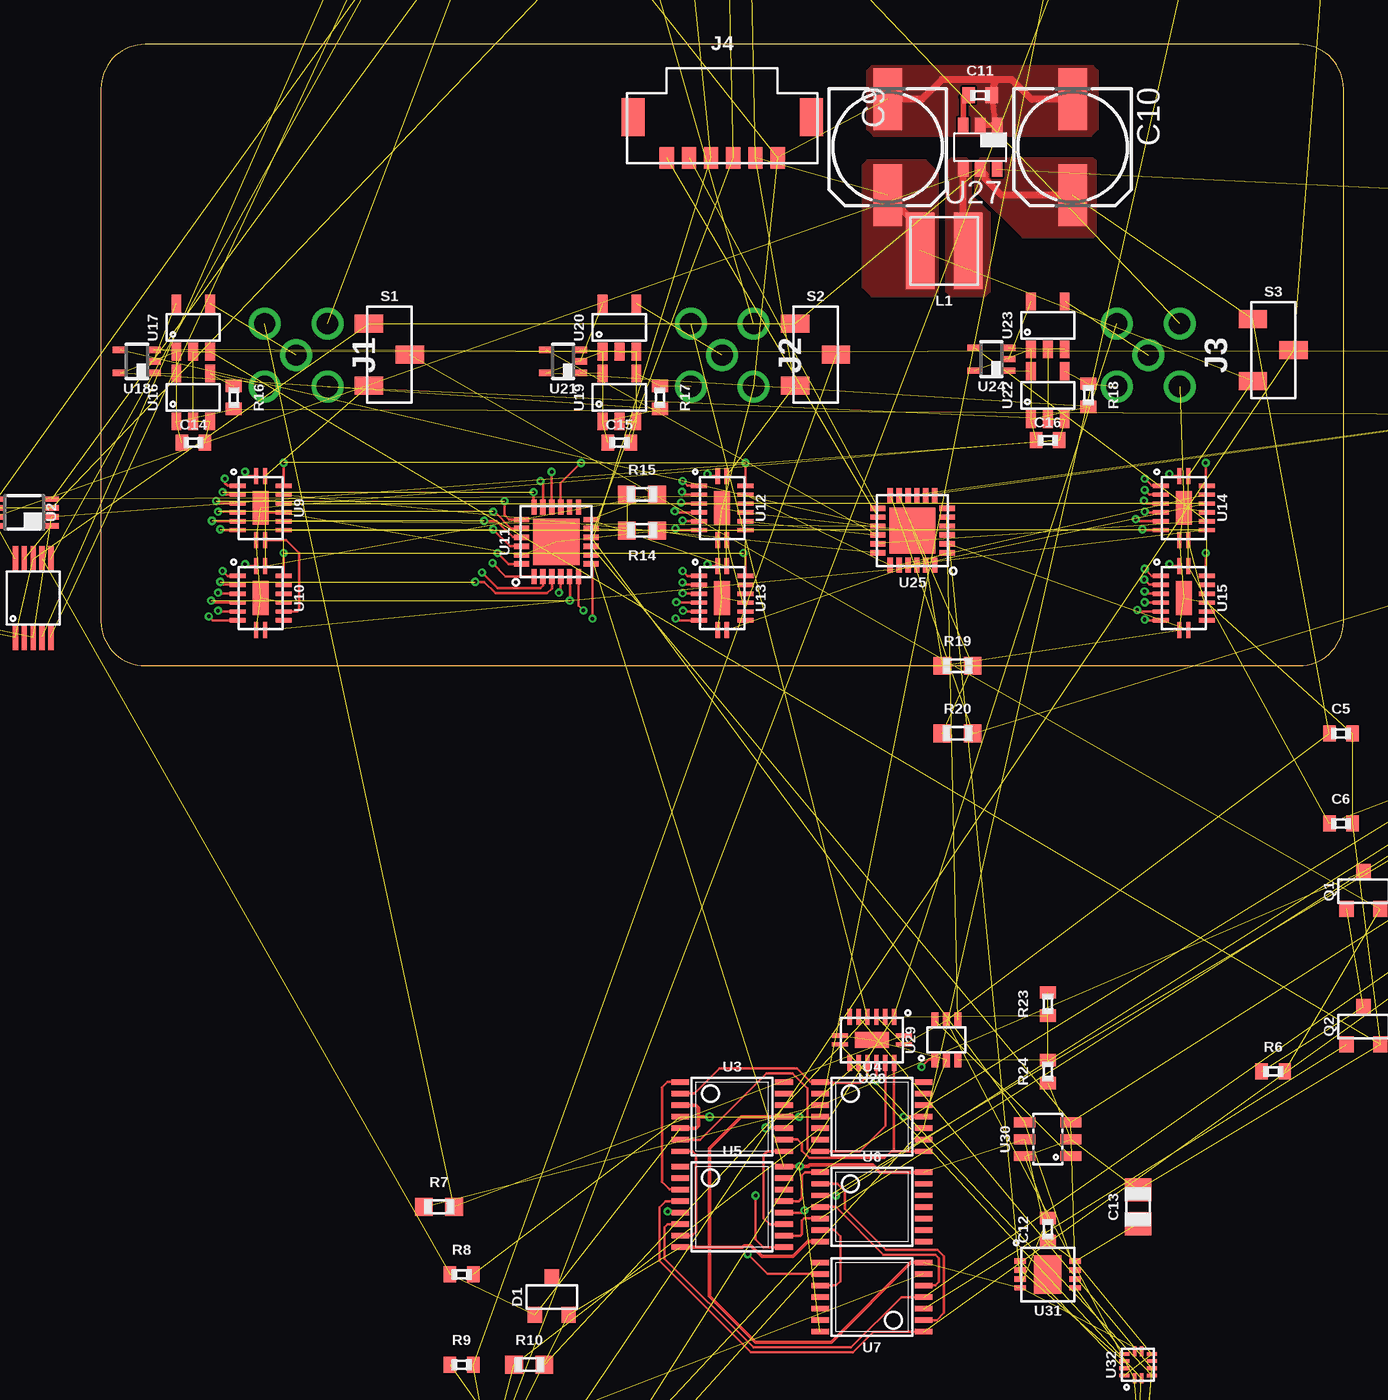
[diagram p3: board, top side]
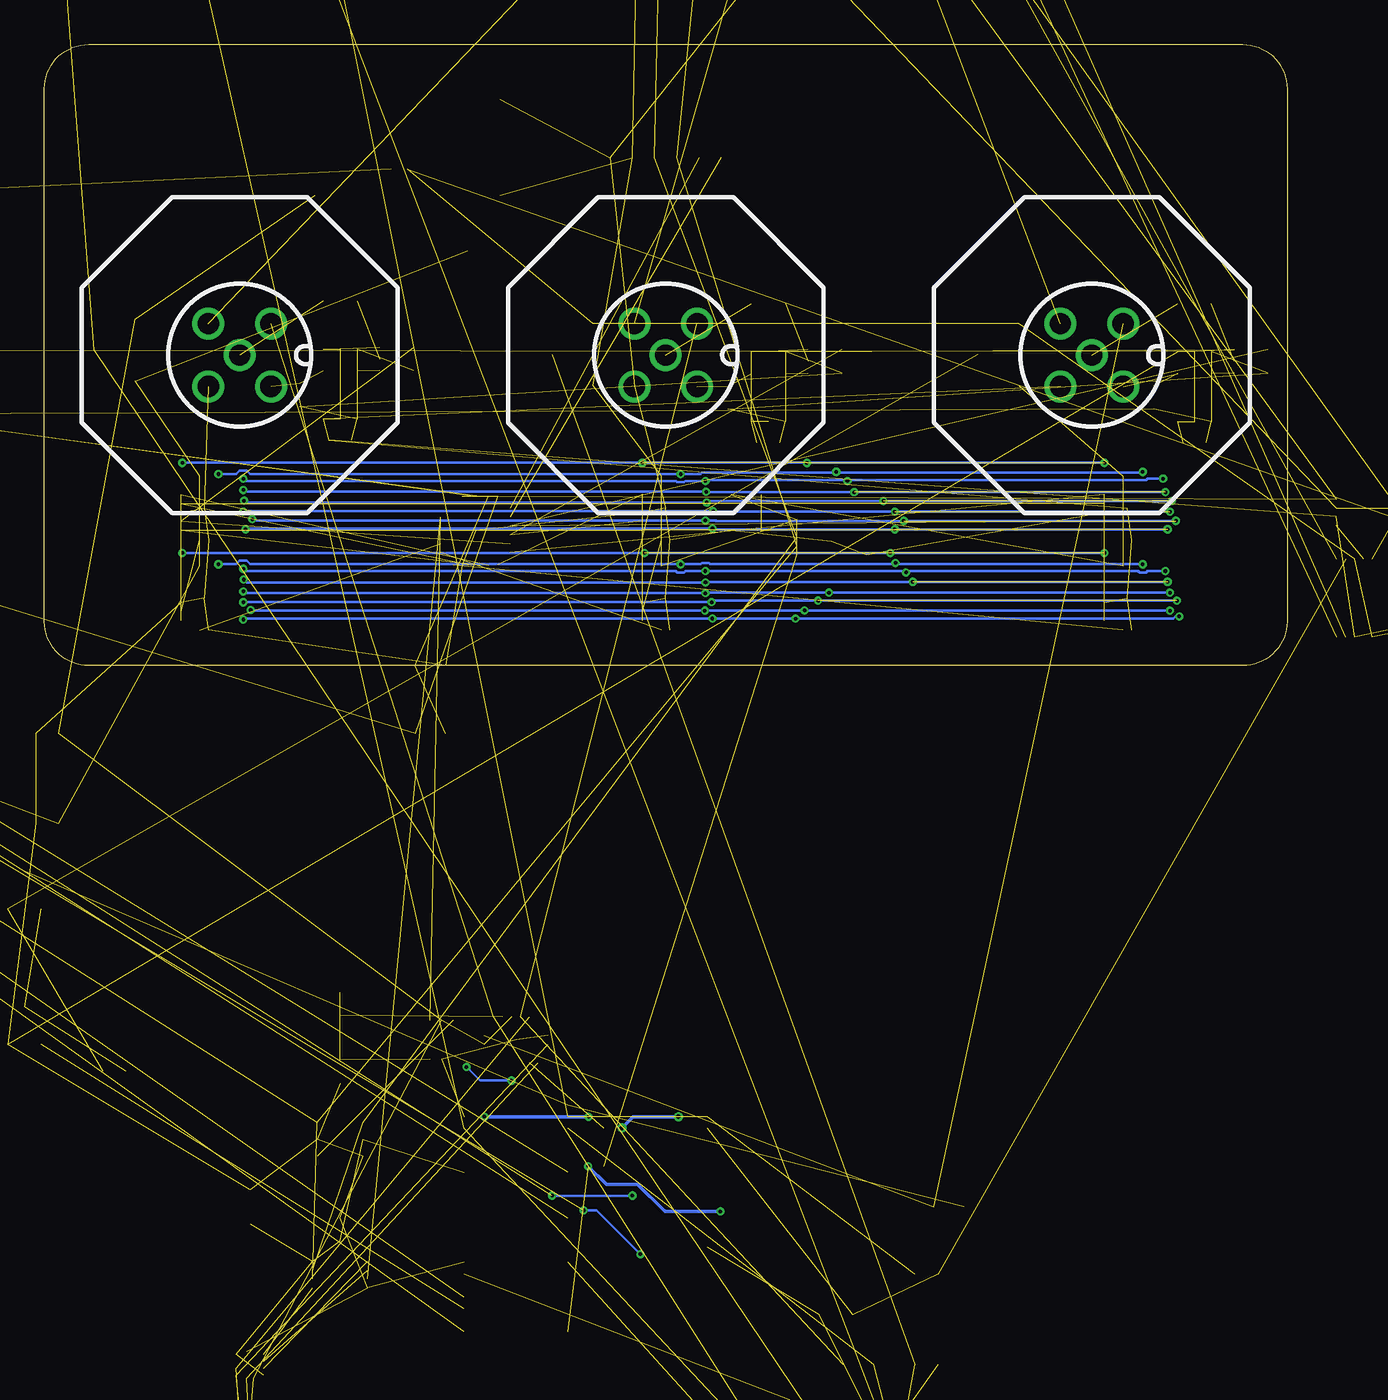
[diagram p4: board, bottom side, seen from below]

Size 70 x 35 mm. Coordinates in mm from the lower left corner, seen from the top.
Outline: 0,32.5 0,2.5 arc90 2.5,0 67.5,0 arc90 70,2.5 70,32.5 arc90 67.5,35 2.5,35 arc90 0,32.5
Copper layers (1*16): Top 0.035559375mm / dielectric 1.6mm / Bottom 0.035559375mm
Design rules "jlcpcb-2layer": minimum track width 5mil, minimum drill 0.2mm, track to track 5mil, track to pad 6mil, pad to pad 5mil, via to via 6mil, smd to smd 5mil, copper to edge 15mil, drill to drill 6mil, minimum pad ring 5mil, minimum via ring 5mil, stop-mask expansion 2.5mil, vias tented up to drill 0mil, thermal gap 10mil

### Footprints (pad centres in the part's own frame; a part is rotated, then mirrored left to right if it is on the bottom)
C0402 = smd 0.7 x 0.9: 1 -0.65,0; 2 0.65,0
C0805 = smd 1.3 x 1.5: 1 -0.95,0; 2 0.95,0
C0603 = smd 1 x 1: 1 -0.85,0; 2 0.85,0
153CLV-0605 = smd 3.5 x 1.6: + 2.7,0; - -2.7,0
SOT23-3 = smd 0.8 x 0.9: 1 -0.95,-1; 2 0.95,-1; 3 0,1.1
1X05_M12_TE_T41410 = drill 1.2: 1 1.768,1.768; 2 -1.768,1.768; 3 -1.768,-1.768; 4 1.768,-1.768; 5 0,0
1X06_MICROLOCKPLUS = smd 0.8 x 1.2: 1 -3.125,-0.6; 2 -1.875,-0.6; 3 -0.625,-0.6; 4 0.625,-0.6; 5 1.875,-0.6; 6 3.125,-0.6 | smd 1.3 x 2.15: BODY@1 -5.025,1.695; BODY@2 5.025,1.695
WE-TPC(3.8X3.8) = smd 1.6 x 4.3: 1 -1.35,0; 2 1.35,0
R0402 = smd 0.7 x 0.9: 1 -0.65,0; 2 0.65,0
R0603 = smd 1 x 1: 1 -0.85,0; 2 0.85,0
CAS-120A1 = smd 1 x 1.6: 1 -1.75,-1.15; 2 0,1.15; 3 1.75,-1.15
VSSOP_10 = smd 0.3 x 1.45: 1 -1,-2.2; 2 -0.5,-2.2; 3 0,-2.2; 4 0.5,-2.2; 5 1,-2.2; 6 1,2.2; 7 0.5,2.2; 8 0,2.2; 9 -0.5,2.2; 10 -1,2.2
DCU_(R-PDSO-G8) = smd 0.3 x 0.8: 1 -0.75,-1.55; 2 -0.25,-1.55; 3 0.25,-1.55; 4 0.75,-1.55; 5 0.75,1.55; 6 0.25,1.55; 7 -0.25,1.55; 8 -0.75,1.55
TSSOP14 = smd 0.305 x 0.991: 1 -1.95,-2.918; 2 -1.3,-2.918; 3 -0.65,-2.918; 4 0,-2.918; 5 0.65,-2.918; 6 1.3,-2.918; 7 1.95,-2.918; 8 1.95,2.918; 9 1.3,2.918; 10 0.65,2.918; 11 0,2.918; 12 -0.65,2.918; 13 -1.3,2.918; 14 -1.95,2.918
TSSOP16 = smd 0.305 x 0.991: 1 -2.275,-2.918; 2 -1.625,-2.918; 3 -0.975,-2.918; 4 -0.325,-2.918; 5 0.325,-2.918; 6 0.975,-2.918; 7 1.625,-2.918; 8 2.275,-2.918; 9 2.275,2.918; 10 1.625,2.918; 11 0.975,2.918; 12 0.325,2.918; 13 -0.325,2.918; 14 -0.975,2.918; 15 -1.625,2.918; 16 -2.275,2.918
TDFN_4 = smd 0.55 x 0.3: 1 -0.725,0.25; 2 -0.725,-0.25; 3 0.725,-0.25; 4 0.725,0.25 | smd 0.5 x 0.86: EP 0,0
VQFN-16 = smd 0.9 x 0.24: 1 -1.8,-0.25; 8 1.8,-0.25; 9 1.8,0.25; 16 -1.8,0.25 | smd 0.24 x 0.9: 2 -1.25,-1.3; 3 -0.75,-1.3; 4 -0.25,-1.3; 5 0.25,-1.3; 6 0.75,-1.3; 7 1.25,-1.3; 10 1.25,1.3; 11 0.75,1.3; 12 0.25,1.3; 13 -0.25,1.3; 14 -0.75,1.3; 15 -1.25,1.3 | smd 1.9 x 0.9: EP 0,0
QFN24 = smd 0.85 x 0.3: 1 -1.95,1.25; 2 -1.95,0.75; 3 -1.95,0.25; 4 -1.95,-0.25; 5 -1.95,-0.75; 6 -1.95,-1.25; 13 1.95,-1.25; 14 1.95,-0.75; 15 1.95,-0.25; 16 1.95,0.25; 17 1.95,0.75; 18 1.95,1.25 | smd 0.3 x 0.85: 7 -1.25,-1.95; 8 -0.75,-1.95; 9 -0.25,-1.95; 10 0.25,-1.95; 11 0.75,-1.95; 12 1.25,-1.95; 19 1.25,1.95; 20 0.75,1.95; 21 0.25,1.95; 22 -0.25,1.95; 23 -0.75,1.95; 24 -1.25,1.95 | smd 2.6 x 2.6: EP 0,0
SOT23-5 = smd 0.55 x 1: 1 -0.95,-1.35; 2 0,-1.35; 3 0.95,-1.35; 4 0.95,1.35; 5 -0.95,1.35
DCK_R-PDSO-G5 = smd 0.35 x 0.8: 1 -0.65,-0.95; 2 0,-0.95; 3 0.65,-0.95; 4 0.65,0.95; 5 -0.65,0.95
TSOT23-6_DDC = smd 0.6 x 0.8: 1 -0.95,-1.25; 2 0,-1.25; 3 0.95,-1.25; 4 0.95,1.25; 5 0,1.25; 6 -0.95,1.25
DCK_R-PDSO-G6 = smd 0.4 x 0.9: 1 -0.65,-1.1; 2 0,-1.1; 3 0.65,-1.1; 4 0.65,1.1; 5 0,1.1; 6 -0.65,1.1
SOT23-6L = smd 0.55 x 1.2: 1 -0.95,-1.3; 2 0,-1.3; 3 0.95,-1.3; 4 0.95,1.3; 5 0,1.3; 6 -0.95,1.3
DFN_8_3X3 = smd 0.65 x 0.3: 1 -1.55,0.75; 2 -1.55,0.25; 3 -1.55,-0.25; 4 -1.55,-0.75; 5 1.55,-0.75; 6 1.55,-0.25; 7 1.55,0.25; 8 1.55,0.75 | smd 1.55 x 2.15: EP 0,0
MLP_12 = smd 0.563 x 0.2: 1 -0.756,0.2; 6 0.756,0.2; 7 0.756,-0.2; 12 -0.756,-0.2 | smd 0.2 x 0.563: 2 -0.6,0.768; 3 -0.2,0.768; 4 0.2,0.768; 5 0.6,0.768; 8 0.6,-0.768; 9 0.2,-0.768; 10 -0.2,-0.768; 11 -0.6,-0.768

### Placement (x,y rotation side)
C1  -8.89,2.54 0 top  (outside the outline)
C2  21.59,55.88 0 top  (outside the outline)
C3  21.59,52.07 0 top  (outside the outline)
C4  21.59,48.26 0 top  (outside the outline)
C5  69.85,-3.81 0 top  (outside the outline)
C6  69.85,-8.89 0 top  (outside the outline)
C7  66.04,80.01 0 top  (outside the outline)
C8  62.23,80.01 0 top  (outside the outline)
C9  44.32,29.21 270 top
C10  54.74,29.21 270 top
C11  49.53,32.13 0 top
C12  53.34,-31.75 90 top  (outside the outline)
C13  58.42,-30.48 90 top  (outside the outline)
C14  5.21,12.57 0 top
C15  29.21,12.57 0 top
C16  53.34,12.7 0 top
D1  25.4,-35.56 0 top  (outside the outline)
J1  11,17.5 90 top
J2  35,17.5 90 top
J3  59,17.5 90 top
J4  35,29.21 0 top
L1  47.5,23.37 0 top
Q1  71.12,-12.7 0 top  (outside the outline)
Q2  71.12,-20.32 0 top  (outside the outline)
Q3  21.59,-46.99 0 top  (outside the outline)
Q4  21.59,-43.18 0 top  (outside the outline)
Q5  71.12,82.55 0 top  (outside the outline)
Q6  21.59,-54.61 0 top  (outside the outline)
R1  35.56,60.96 0 top  (outside the outline)
R2  31.75,60.96 0 top  (outside the outline)
R3  27.94,60.96 0 top  (outside the outline)
R4  24.13,60.96 0 top  (outside the outline)
R5  20.32,60.96 0 top  (outside the outline)
R6  66.04,-22.86 0 top  (outside the outline)
R7  19.05,-30.48 0 top  (outside the outline)
R8  20.32,-34.29 0 top  (outside the outline)
R9  20.32,-39.37 0 top  (outside the outline)
R10  24.13,-39.37 0 top  (outside the outline)
R11  20.32,-50.8 0 top  (outside the outline)
R12  24.13,-50.8 0 top  (outside the outline)
R13  58.42,80.01 0 top  (outside the outline)
R14  30.48,7.62 180 top
R15  30.48,9.65 0 top
R16  7.49,15.11 270 top
R17  31.5,15.11 270 top
R18  55.63,15.24 270 top
R19  48.26,0 0 top
R20  48.26,-3.81 0 top  (outside the outline)
R21  128.27,17.78 0 top  (outside the outline)
R22  128.27,13.97 0 top  (outside the outline)
R23  53.34,-19.05 90 top  (outside the outline)
R24  53.34,-22.86 90 top  (outside the outline)
R25  58.42,-43.18 90 top  (outside the outline)
R26  58.42,-46.99 90 top  (outside the outline)
R27  58.42,-50.8 90 top  (outside the outline)
S1  16.26,17.53 270 top
S2  40.26,17.53 270 top
S3  66.04,17.78 270 top
U1  -3.81,3.81 0 top
U2  -4.33,8.64 90 top
U3  35.56,-25.4 270 top  (outside the outline)
U4  43.43,-25.4 270 top  (outside the outline)
U5  35.56,-30.48 270 top  (outside the outline)
U6  43.43,-30.48 270 top  (outside the outline)
U7  43.43,-35.56 90 top  (outside the outline)
U8  69.85,78.74 0 top  (outside the outline)
U9  9,8.89 270 top
U10  9,3.81 270 top
U11  25.65,6.99 90 top
U12  35,8.89 270 top
U13  35,3.81 270 top
U14  61,8.89 270 top
U15  61,3.81 270 top
U16  5.21,15.11 0 top
U17  5.21,19.05 0 top
U18  2.03,17.14 90 top
U19  29.21,15.11 0 top
U20  29.21,19.05 0 top
U21  26.04,17.14 90 top
U22  53.34,15.24 0 top
U23  53.34,19.18 0 top
U24  50.16,17.27 90 top
U25  45.72,7.62 180 top
U26  128.27,22.86 0 top  (outside the outline)
U27  49.53,29.21 180 top
U28  43.43,-21.08 180 top  (outside the outline)
U29  47.62,-21.08 0 top  (outside the outline)
U30  53.34,-26.67 90 top  (outside the outline)
U31  53.34,-34.29 0 top  (outside the outline)
U32  58.42,-39.37 90 top  (outside the outline)

### Tracks (layer width: path | path; a pad name or v marks a point on that pad's centre or on a via)
3V3  (via drill 0.2)  (49 unrouted)
  Top 0.152: U5.5 32,-30.8 v31.93,-30.73 | v39.37,-28.19 39.35,-28.2
  Top 0.2: U6.14 43.9,-28.53 43.49,-28.12 39.92,-28.12 39.85,-28.19 v39.37,-28.19 38.49,-28.19 U5.16
  Top 0.406: L1.1 46.15,24.68 C9.+
  Bottom 0.2: v39.37,-28.19 38.34,-29.21 36.58,-29.21 35.05,-30.73 v31.93,-30.73
  pour Top (rank 2, no thermals): 43.43,20.83 46.86,20.83 47.12,21.08 47.12,27.81 46.48,28.45 43.18,28.45 42.93,28.19 42.93,21.34
3V3_SENSE  (4 unrouted)
5V  (15 unrouted)
  Top 0.406: U27.5 49.82,27.67 49.82,27.41 50.73,26.51 C10.+
  pour Top (rank 2, no thermals): 55.88,24.13 51.94,24.13 49.28,26.8 49.28,28.32 49.53,28.57 55.88,28.57 56.01,28.45 56.01,24.26
5V_EN  (1 unrouted)
!FAULT1  (1 unrouted)
  Top 0.152: U5.13 39.31,-30.16 39.5,-29.97 39.5,-28.7 39.67,-28.53 U6.1
!FAULT2  (via drill 0.2)  (1 unrouted)
  Top 0.152: U6.3 41.39,-29.83 v41.4,-29.84 | v36.88,-29.84 36.88,-32.31 37.33,-32.76 U5.9
  Bottom 0.152: v41.4,-29.84 v36.88,-29.84
!FAULT3  (1 unrouted)
  Top 0.152: U5.10 39.4,-32.1 39.5,-32 39.5,-31.24 39.61,-31.13 U6.5
!OVF1  (1 unrouted)
!OVF2  (1 unrouted)
!OVF3  (1 unrouted)
!RST  (6 unrouted)
AIN1  (1 unrouted)
AIN1_FILT  (2 unrouted)
AIN2  (1 unrouted)
AIN2_FILT  (2 unrouted)
AIN3  (1 unrouted)
AIN3_FILT  (2 unrouted)
C0  (via drill 0.2)  (4 unrouted)
  Top 0.152: U9.15 10.29,10.15 v10.29,11.43 | U12.15 36.3,11.41 v36.32,11.43 | U14.15 62.23,10.21 v62.23,11.43 | U11.15 25.9,10.28 v27.05,11.43
  Bottom 0.152: v10.29,11.43 v27.05,11.43 v36.32,11.43 v62.23,11.43
C1  (via drill 0.2)
  Top 0.152: v8.13,10.92 8.13,10.8 8.24,10.69 U9.1 | U12.1 34.27,10.69 v34.16,10.79 | U14.1 60.3,10.69 v60.2,10.79 | U11.16 v25.4,10.92
  Bottom 0.152: 25.45,10.87 32.95,10.87 33.03,10.79 v34.16,10.79 58.41,10.79 58.61,11 58.99,11 59.19,10.79 v60.2,10.79 | 25.45,10.87 8.18,10.87 v8.13,10.92 | v25.4,10.92 25.45,10.87
C2  (via drill 0.2)
  Top 0.152: U9.2 7.13,10.14 6.99,10.29 v6.99,10.54 | U12.2 33.04,10.14 v32.77,10.41 | U14.2 59.2,10.14 v58.8,10.54 | U11.17 24.9,10.28 v24.77,10.41
  Bottom 0.152: v6.99,10.54 7.87,10.54 7.94,10.47 24.71,10.47 | 24.71,10.47 32.71,10.47 v32.77,10.41 33.9,10.41 33.97,10.34 34.35,10.34 34.43,10.41 58.67,10.41 v58.8,10.54 | v24.77,10.41 24.71,10.47
C3  (via drill 0.2)  (2 unrouted)
  Top 0.152: U9.3 6.99,9.64 v6.85,9.77 | U12.3 32.9,9.64 v32.73,9.81 | U14.3 59.06,9.64 v58.8,9.9 | U11.18 24.38,8.96 v24.38,9.77
  Bottom 0.152: v6.85,9.77 v24.38,9.77 32.7,9.77 v32.73,9.81 58.7,9.81 v58.8,9.9
C4  (via drill 0.2)  (2 unrouted)
  Top 0.152: U9.4 6.63,9.14 v6.49,9.28 | U12.4 32.75,9.14 v32.69,9.2 | U14.4 58.91,9.14 v58.76,9.29 | U11.19 23.01,8.23 22.73,8.51 v22.73,9.28
  Bottom 0.152: v6.49,9.28 v22.73,9.28 32.61,9.28 v32.69,9.2 58.66,9.2 v58.76,9.29
C5  (via drill 0.2)  (2 unrouted)
  Top 0.152: U9.5 7.66,8.68 v6.6,8.68 | U12.5 32.39,8.64 v32.33,8.71 | U14.5 58.84,8.64 v58.8,8.68 | v22.1,8.68 22.17,8.68 23.11,7.74 U11.20
  Bottom 0.152: v6.6,8.68 v22.1,8.68 32.3,8.68 v32.33,8.71 58.1,8.71 58.77,8.71 v58.8,8.68
C6  (via drill 0.2)  (2 unrouted)
  Top 0.152: U9.6 6.28,8.14 v6.26,8.16 | U12.6 32.81,8.14 v32.77,8.18 | U14.6 58.41,8.14 v58.29,8.26 | U11.21 23.22,7.24 22.29,8.16 v21.59,8.16
  Bottom 0.152: v6.26,8.16 v21.59,8.16 32.16,8.16 32.18,8.18 v32.77,8.18 58.22,8.18 v58.29,8.26
C7  (via drill 0.2)  (2 unrouted)
  Top 0.152: U9.7 6.78,7.64 v6.73,7.68 | U12.7 32.45,7.64 v32.37,7.73 | U14.7 58.72,7.64 v58.67,7.68 | U11.22 23.05,6.74 v22.1,7.68
  Bottom 0.152: v6.73,7.68 v22.1,7.68 32.32,7.68 v32.37,7.73 58.63,7.73 v58.67,7.68
C8  (via drill 0.2)  (4 unrouted)
  Top 0.152: U13.15 36.3,6.25 v36.2,6.35 | U10.15 10.3,6.34 v10.29,6.35 | U15.15 62.23,5.13 v62.23,6.35 | U11.24 22.97,5.74 v22.35,6.35
  Bottom 0.152: v10.29,6.35 v22.35,6.35 v36.2,6.35 v62.23,6.35
C9  (via drill 0.2)
  Top 0.152: U13.1 34.27,5.61 v34.16,5.71 | U10.1 8.23,5.61 v8.13,5.71 | U15.1 60.3,5.61 v60.2,5.71 | U11.1 22.81,5.04 v22.05,5.79
  Bottom 0.152: v8.13,5.71 22.1,5.71 | 22.1,5.71 32.5,5.71 32.58,5.79 32.95,5.79 33.03,5.71 v34.16,5.71 58.41,5.71 58.61,5.92 58.99,5.92 59.19,5.71 v60.2,5.71 | v22.05,5.79 22.1,5.75 22.1,5.71
C10  (via drill 0.2)
  Top 0.152: U10.2 7.13,5.06 v6.86,5.33 | U13.2 33.04,5.06 v32.77,5.33 | U15.2 59.2,5.06 v58.8,5.46 | v21.46,5.26 22.34,4.38 24.78,4.38 24.9,4.51 U11.2
  Bottom 0.152: v6.86,5.33 7.87,5.33 7.94,5.26 8.32,5.26 8.39,5.33 21.54,5.33 | 21.54,5.33 v32.77,5.33 33.9,5.33 33.97,5.26 34.35,5.26 34.43,5.33 58.67,5.33 v58.8,5.46 | v21.46,5.26 21.54,5.33
C11  (via drill 0.2)  (2 unrouted)
  Top 0.152: U10.3 6.9,4.56 v6.73,4.73 | U13.3 32.9,4.56 v32.76,4.69 | U15.3 59.06,4.56 v58.76,4.86 | v21.08,4.73 21.6,4.73 22.23,4.1 25.14,4.1 25.4,4.36 U11.3
  Bottom 0.152: v6.73,4.73 v21.08,4.73 32.73,4.73 v32.76,4.69 58.6,4.69 v58.76,4.86
C12  (via drill 0.2)
  Top 0.152: U10.4 6.67,4.06 v6.6,4.12 | U13.4 32.79,4.06 v32.77,4.09 | U15.4 58.91,4.06 v58.79,4.18 | U11.4 25.9,4.22 v25.81,4.12
  Bottom 0.152: v6.6,4.12 v25.81,4.12 | v25.81,4.12 32.73,4.12 v32.77,4.09 58.7,4.09 v58.79,4.18 | v25.81,4.12
C13  (via drill 0.2)  (2 unrouted)
  Top 0.152: U10.5 6.31,3.56 v6.2,3.66 | U13.5 32.44,3.56 v32.41,3.58 | U15.5 58.82,3.56 v58.8,3.58 | U11.5 26.42,5.02 v26.42,3.66
  Bottom 0.152: v6.2,3.66 v26.42,3.66 32.33,3.66 v32.41,3.58 58.18,3.58 58.19,3.59 58.78,3.59 v58.8,3.58
C14  (via drill 0.2)
  Top 0.152: U10.6 6.65,3.06 v6.6,3.1 | U13.6 32.84,3.06 v32.79,3.1 | U15.6 58.46,3.06 v58.38,3.14 | U11.6 26.9,3.39 v27.18,3.12
  Bottom 0.152: v6.6,3.1 27.19,3.1 | 27.19,3.1 32.18,3.1 32.19,3.12 32.57,3.12 32.58,3.1 v32.79,3.1 58.35,3.1 v58.38,3.14 | v27.18,3.12 27.19,3.1
C15  (via drill 0.2)
  Top 0.152: U10.7 6.29,2.56 v6.08,2.77 | U13.7 32.48,2.56 v32.38,2.66 | U15.7 58.84,2.56 v58.8,2.6 | U11.7 27.69,5.65 v27.69,2.65
  Bottom 0.152: v6.08,2.77 6.29,2.77 6.42,2.65 6.79,2.65 6.8,2.66 v27.7,2.66 | v27.7,2.66 v32.38,2.66 32.59,2.66 32.6,2.65 58.76,2.65 v58.8,2.6 | v27.69,2.65 v27.7,2.66
COUNT_EN1  (2 unrouted)
COUNT_EN2  (2 unrouted)
COUNT_EN3  (2 unrouted)
D1  (1 unrouted)
D2  (1 unrouted)
D3  (1 unrouted)
EN1  (1 unrouted)
  Top 0.152: U7.1 43.53,-37.51 42.36,-38.68 36.63,-38.68 31.47,-33.52 31.47,-30.5 31.81,-30.16 U5.4
EN2  (1 unrouted)
  Top 0.152: U7.4 45.09,-35.56 42.25,-38.4 36.75,-38.4 31.75,-33.4 31.75,-31.62 31.92,-31.45 U5.6
EN3  (via drill 0.2)  (1 unrouted)
  Top 0.152: U7.9 37.56,-34.26 36.45,-33.15 v36.43,-33.15 | v39.62,-30.67 39.49,-30.8 U5.12
  Bottom 0.152: v36.43,-33.15 38.9,-30.67 v39.62,-30.67
FAULT1
  Top 0.152: U7.2 47.09,-36.86 47.5,-36.45 47.5,-33.27 47.12,-32.89 44.21,-32.89 41.91,-30.59 41.91,-29.59 41.5,-29.18 U6.2
FAULT2
  Top 0.152: U6.4 41.4,-30.48 44.09,-33.17 47,-33.17 47.22,-33.39 47.22,-34.7 47.01,-34.91 U7.5
FAULT3
  Top 0.152: U7.10 41.42,-34.91 41.66,-34.67 41.66,-32.13 41.3,-31.78 U6.6
GND  (via drill 0.2)  (76 unrouted)
  Top 0.152: U9.12 9.25,8.64 U9.EP
  Top 0.2: U6.7 39.83,-32.43 38.99,-33.27 37.23,-33.27 36.62,-32.67 36.23,-32.67 36.14,-32.76 34.29,-32.76 | U5.8 34.29,-32.76 | v39.34,-25.4 U3.11 36.07,-25.4 34.29,-27.18 34.29,-32.76 | v45.21,-25.4 U4.11 | U7.7 45.64,-33.61 41.15,-38.1 36.87,-38.1 34.29,-35.51 34.29,-32.76
  Top 0.305: C11.2 50.38,30.56 U27.1 U27.2
  Top 0.406: C10.- 52.42,31.91 51.31,33.02 50.42,33.02 | 50.42,33.02 47.37,33.02 46.26,31.91 C9.- | C11.2 50.38,32.98 50.42,33.02
  Bottom 0.2: v39.34,-25.4 v45.21,-25.4
  pour Top (rank 2, no thermals): 55.75,29.84 43.56,29.84 43.18,30.23 43.18,33.53 43.43,33.78 55.88,33.78 56.13,33.53 56.13,30.23
GPIOA  (1 unrouted)
GPIOB  (1 unrouted)
LATCH1
  Top 0.152: U3.1 31.92,-23.45 31.62,-23.75 31.62,-29.08 32.05,-29.5 U5.3
LATCH2
  Top 0.152: U5.7 33.3,-32.1 33.53,-31.88 33.53,-27.56 33.32,-27.35 U3.7
LATCH3
  Top 0.152: U3.8 37.55,-27.35 37.34,-27.56 37.34,-31.11 37.68,-31.45 U5.11
LOAD  (6 unrouted)
MOS_CTRL1  (1 unrouted)
MOS_CTRL2  (1 unrouted)
MOS_CTRL3  (1 unrouted)
MUX_EN  (2 unrouted)
MUX_SEL0  (2 unrouted)
MUX_SEL1  (2 unrouted)
MUX_SEL2  (2 unrouted)
N$1  (2 unrouted)
N$2  (2 unrouted)
N$3  (2 unrouted)
N$4
  Top 0.152: U10.11 11.06,3.06 11.18,3.17 11.18,6.36 10.45,7.09 U9.9
N$5  (1 unrouted)
N$6  (1 unrouted)
N$7  (2 unrouted)
N$8  (1 unrouted)
N$9  (1 unrouted)
N$10  (1 unrouted)
N$11  (1 unrouted)
N$12  (1 unrouted)
N$13  (1 unrouted)
N$14  (2 unrouted)
N$15
  Top 0.305: C11.1 48.58,32.03 U27.3
N$16  (2 unrouted)
N$17
  Top 0.406: L1.2 48.58,23.64 U27.4
  pour Top (no thermals): 49.02,26.54 49.02,28.32 48.77,28.57 47.88,28.57 47.62,28.32 47.62,21.08 47.88,20.83 49.78,20.83 50.04,21.08 50.04,25.53
N$18  (1 unrouted)
N$19  (2 unrouted)
N$24  (1 unrouted)
N$25  (1 unrouted)
N$28  (1 unrouted)
N$38  (via drill 0.2)
  Top 0.152: U28.13 v43.68,-23.36 v43.69,-23.37 | v46.23,-22.61 46.65,-22.18 U29.1
  Bottom 0.152: v43.69,-23.37 45.47,-23.37 v46.23,-22.61
OD1  (2 unrouted)
OD2  (2 unrouted)
OD3  (2 unrouted)
OUT1  (2 unrouted)
OUT2  (2 unrouted)
OUT3  (2 unrouted)
SCL  (7 unrouted)
SCL_HV  (1 unrouted)
SDA  (7 unrouted)
SDA_HV  (1 unrouted)
SENSE1
  Top 0.152: U3.2 33.43,-24.1 34.84,-22.69 39.2,-22.69 39.96,-23.45 U4.1 40.56,-23.5 42.8,-23.5 43.18,-23.11 U28.12
SENSE1+  (2 unrouted)
SENSE2
  Top 0.152: U3.6 33.75,-26.7 37.48,-22.97 38.97,-22.97 39.79,-23.79 39.79,-27.22 39.92,-27.35 U4.7 42.75,-27.35 44.18,-25.92 U28.14
SENSE2+  (2 unrouted)
SENSE3
  Top 0.152: U4.8 44.7,-27.35 | 44.7,-27.35 44.53,-27.35 44.15,-27.73 39.91,-27.73 39.5,-27.32 39.5,-26.92 39.24,-26.67 38.51,-26.67 U3.9 | U28.15 44.68,-27.33 44.7,-27.35
SENSE3+  (2 unrouted)
SENSE_EN  (2 unrouted)
SWITCHED_SENSE  (1 unrouted)
VPORT1_IN  (2 unrouted)
VPORT1_OUT  (2 unrouted)
VPORT2_IN  (2 unrouted)
VPORT2_OUT  (2 unrouted)
VPORT3_IN  (2 unrouted)
VPORT3_OUT  (2 unrouted)
VREF  (via drill 0.25)  (4 unrouted)
  Top 0.2: U3.5 33.51,-26.05 33.66,-25.91 33.66,-25.4 | 33.66,-25.4 33.66,-24.89 33.51,-24.75 U3.3 | 33.66,-25.4 v34.29,-25.4 | v37.47,-26.04 38.46,-26.04 U3.10
  Bottom 0.2: v34.29,-25.4 36.83,-25.4 v37.47,-26.04